# Altium project Motor control board.PrjPcb (part 1 of 2)
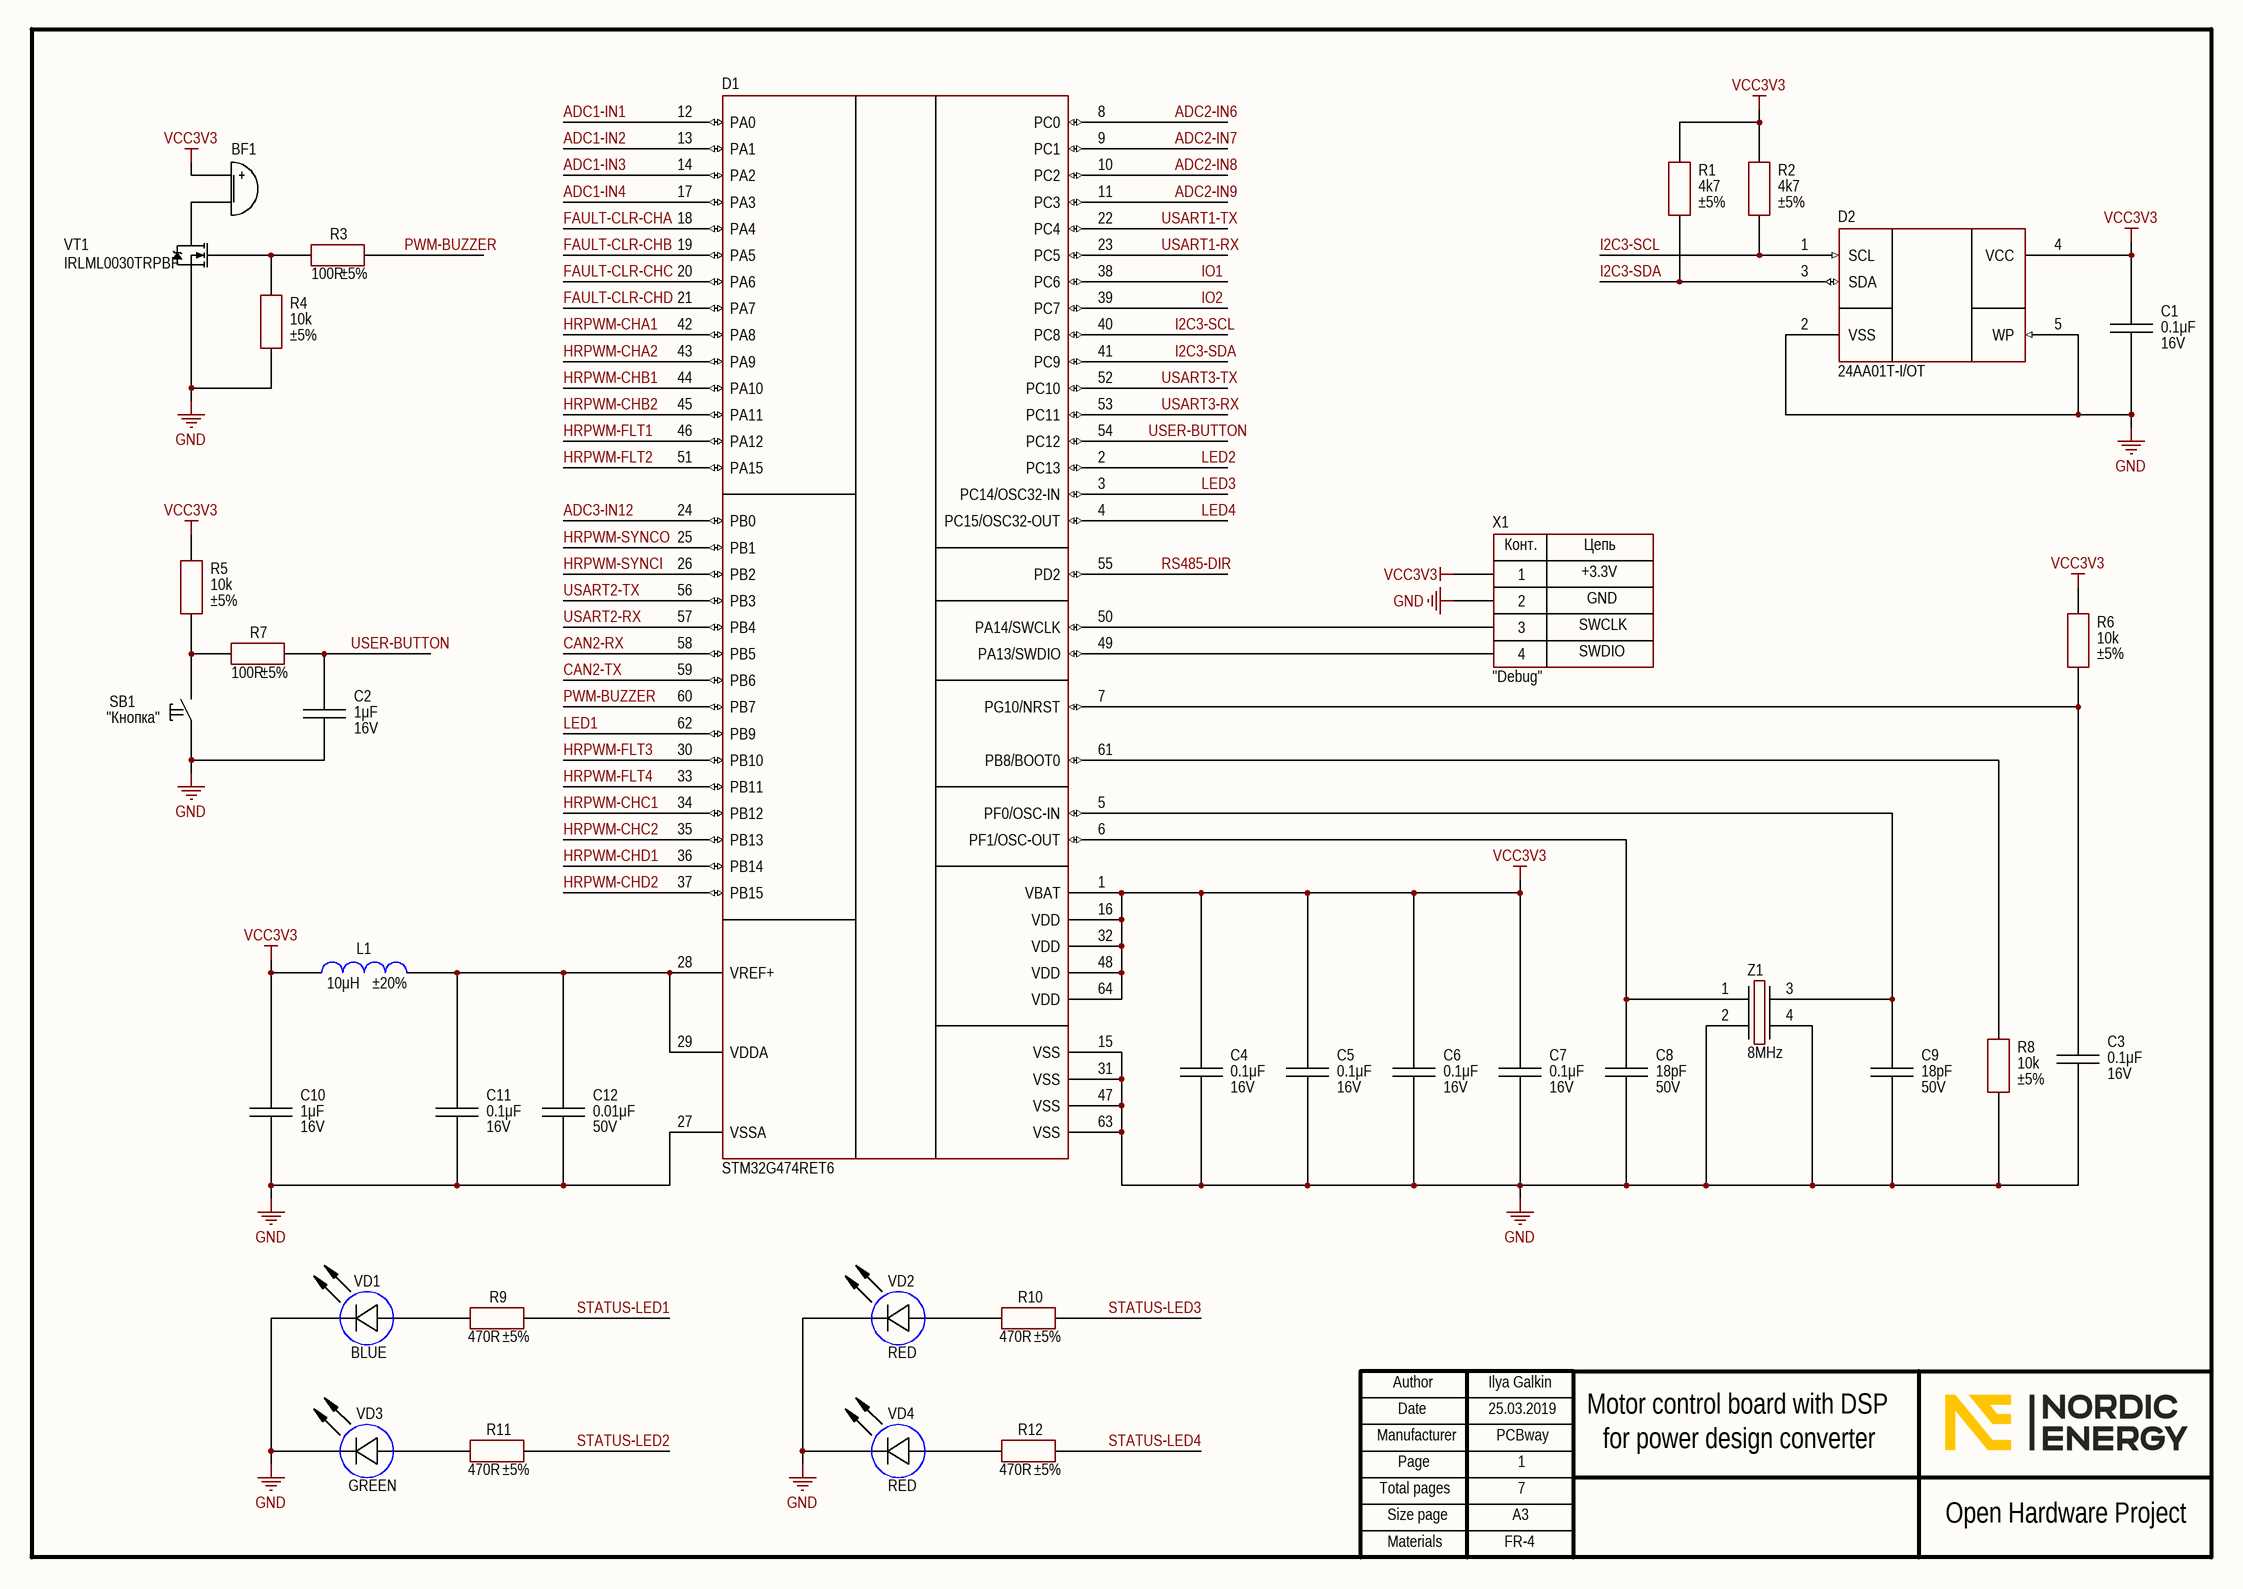
[diagram p0: Main MCU. Page 1.SchDoc]
7 sheets, 169 parts. Net scope: global (net labels, ports and power ports of the same name join across sheets).
Board file: PCB for control board.PcbDoc
Sheets:
  Main MCU. Page 1.SchDoc
  Protection channel A. Page 2.SchDoc
  Protection channel B. Page 3.SchDoc
  Protection channel C. Page 4.SchDoc
  Protection channel D. Page 5.SchDoc
  USB and CAN. Page 6.SchDoc
  Power and system. Page 7.SchDoc

## Sheet Main MCU. Page 1.SchDoc
size 420 x 297 mm; Address1: Address1; Address2: Address2; Address3: Address3; Address4: Address4; DocumentNumber: АБВГ.123456.001 Э3; SheetNumber: 1; SheetTotal: 7; Scale: 1:1; DocumentType: Схема электрическая принципиальная; FirstReferrence: АБВГ.123456.001

### Parts
BF1  (no value)  [BUZ: AT-0927-TT-6-R]
C1  value 0.1μF  Voltage: 16V  [CAP: 0805]
C2  value 1μF  Voltage: 16V  [CAP: 0805]
C3  value 0.1μF  Voltage: 16V  [CAP: 0805]
C4  value 0.1μF  Voltage: 16V  [CAP: 0805]
C5  value 0.1μF  Voltage: 16V  [CAP: 0805]
C6  value 0.1μF  Voltage: 16V  [CAP: 0805]
C7  value 0.1μF  Voltage: 16V  [CAP: 0805]
C8  value 18pF  Voltage: 50V  [CAP: 0805]
C9  value 18pF  Voltage: 50V  [CAP: 0805]
C10  value 1μF  Voltage: 16V  [CAP: 0805]
C11  value 0.1μF  Voltage: 16V  [CAP: 0805]
C12  value 0.01μF  Voltage: 50V  [CAP: 0805]
D1  (no value)  [64-LQFP]
D2  PartNumber: 24AA01T-I/OT  [SOT23-5]
L1  value 10μH  Tolerance: ±20%  [IND: 0805]
R1  value 4k7  Tolerance: ±5%  [RES: 0805]
R2  value 4k7  Tolerance: ±5%  [RES: 0805]
R3  value 100R  Tolerance: ±5%  [RES: 0805]
R4  value 10k  Tolerance: ±5%  [RES: 0805]
R5  value 10k  Tolerance: ±5%  [RES: 0805]
R6  value 10k  Tolerance: ±5%  [RES: 0805]
R7  value 100R  Tolerance: ±5%  [RES: 0805]
R8  value 10k  Tolerance: ±5%  [RES: 0805]
R9  value 470R  Tolerance: ±5%  [RES: 0805]
R10  value 470R  Tolerance: ±5%  [RES: 0805]
R11  value 470R  Tolerance: ±5%  [RES: 0805]
R12  value 470R  Tolerance: ±5%  [RES: 0805]
SB1  CommentText: "Кнопка"  [BUT: 6x6 SMD]
VD1  Color: BLUE  [LED: 0805B]
VD2  Color: RED  [LED: 0805R]
VD3  Color: GREEN  [LED: 0603G]
VD4  Color: RED  [LED: 0805R]
VT1  PartNumber: IRLML0030TRPBF  [SOT23]
X1  CommentText: "Debug"  [CON: SM04B-GHS]
Z1  Frequency: 8MHz  [OSC: 5032]

### Nets
GND: C1.1 C2.1 C3.1 C4.1 C5.1 C6.1 C7.1 C8.1 C9.1 C10.1 C11.1 C12.1 D1.15(VSS) D1.27(VSSA) D1.31(VSS) D1.47(VSS) D1.63(VSS) D2.2(VSS) D2.5(WP) R4.2 R8.2 SB1.1 VD1.2(C) VD2.2(C) VD3.2(C) VD4.2(C) VT1.2(S) X1.2 Z1.2 Z1.4
VCC3V3: BF1.1(+) C1.2 C4.2 C5.2 C6.2 C7.2 C10.2 D1.1(VBAT) D1.16(VDD) D1.32(VDD) D1.48(VDD) D1.64(VDD) D2.4(VCC) L1.2 R1.1 R2.1 R5.1 R6.1 X1.1
ADC1-IN1: D1.12(PA0)
ADC1-IN2: D1.13(PA1)
ADC1-IN3: D1.14(PA2)
ADC1-IN4: D1.17(PA3)
ADC2-IN6: D1.8(PC0)
ADC2-IN7: D1.9(PC1)
ADC2-IN8: D1.10(PC2)
ADC2-IN9: D1.11(PC3)
ADC3-IN12: D1.24(PB0)
CAN2-RX: D1.58(PB5)
CAN2-TX: D1.59(PB6)
FAULT-CLR-CHA: D1.18(PA4)
FAULT-CLR-CHB: D1.19(PA5)
FAULT-CLR-CHC: D1.20(PA6)
FAULT-CLR-CHD: D1.21(PA7)
HRPWM-CHA1: D1.42(PA8)
HRPWM-CHA2: D1.43(PA9)
HRPWM-CHB1: D1.44(PA10)
HRPWM-CHB2: D1.45(PA11)
HRPWM-CHC1: D1.34(PB12)
HRPWM-CHC2: D1.35(PB13)
HRPWM-CHD1: D1.36(PB14)
HRPWM-CHD2: D1.37(PB15)
HRPWM-FLT1: D1.46(PA12)
HRPWM-FLT2: D1.51(PA15)
HRPWM-FLT3: D1.30(PB10)
HRPWM-FLT4: D1.33(PB11)
HRPWM-SYNCI: D1.26(PB2)
HRPWM-SYNCO: D1.25(PB1)
I2C3-SCL: D1.40(PC8) D2.1(SCL) R2.2
I2C3-SDA: D1.41(PC9) D2.3(SDA) R1.2
IO1: D1.38(PC6)
IO2: D1.39(PC7)
LED1: D1.62(PB9)
LED2: D1.2(PC13)
LED3: D1.3(PC14/OSC32-IN)
LED4: D1.4(PC15/OSC32-OUT)
PWM-BUZZER: D1.60(PB7) R3.2
RS485-DIR: D1.55(PD2)
STATUS-LED1: R9.2
STATUS-LED2: R11.2
STATUS-LED3: R10.2
STATUS-LED4: R12.2
USART1-RX: D1.23(PC5)
USART1-TX: D1.22(PC4)
USART2-RX: D1.57(PB4)
USART2-TX: D1.56(PB3)
USART3-RX: D1.53(PC11)
USART3-TX: D1.52(PC10)
USER-BUTTON: C2.2 D1.54(PC12) R7.2
NetBF1_2: BF1.2(-) VT1.3(D)
NetC3_2: C3.2 D1.7(PG10/NRST) R6.2
NetC8_2: C8.2 D1.6(PF1/OSC-OUT) Z1.1
NetC9_2: C9.2 D1.5(PF0/OSC-IN) Z1.3
NetC11_2: C11.2 C12.2 D1.28(VREF+) D1.29(VDDA) L1.1
NetD1_49: D1.49(PA13/SWDIO) X1.4
NetD1_50: D1.50(PA14/SWCLK) X1.3
NetD1_61: D1.61(PB8/BOOT0) R8.1
NetR3_1: R3.1 R4.1 VT1.1(G)
NetR5_2: R5.2 R7.1 SB1.2
NetR9_1: R9.1 VD1.1(A)
NetR10_1: R10.1 VD2.1(A)
NetR11_1: R11.1 VD3.1(A)
NetR12_1: R12.1 VD4.1(A)

### Notes on the sheet
- +3.3V
- SWDIO
- SWCLK
- GND
- Ilya Galkin
- 25.03.2019
- PCBway
- 1
- Motor control board with DSP
- for power design converter
- 7
- FR-4
- Author
- Manufacturer
- Date
- Page
- Total pages
- Size page
- A3
- Open Hardware Project
- Materials
- (in symbol Connector_SM04B) Конт.; Цепь

### Library data of the parts
BF1 = Buzzer: Manufacturer: PUI Audio; ValueManufacturerPartNumber: DIP switch, 2.73 kHz, 3VDC, 80mA, -20...+70°C; PartNumber: AT-0927-TT-6-R; TypeBuzzer: DIP switch; VoltageMax: 3VDC; Frequency: 2.73 kHz; CurrentMax: 80mA; HelpURL: https://www.digikey.com/products/en?keywords=AT-0927-TT-6-R; Temperature: -20...+70°C
C1 C3-C7 C11 = Ceramic_0805: Manufacturer: Yageo; PartNumber: CC0805KRX7R7BB104; ValueManufacturerPartNumber: Ceramic capacitor, 0.1μF, X7R, ±10%, 16V, 0805, -55...+125°C; TypeCapacitor: Ceramic capacitor; Tolerance: ±10%; TypeDielectric: X7R; Package: 0805; HelpURL: https://www.digikey.com/product-detail/en/yageo/CC0805KRX7R7BB104/311-1142-1-ND/303052; Temperature: -55...+125°C
C2 C10 = Ceramic_0805: Manufacturer: Yageo; PartNumber: CC0805KKX7R7BB105; ValueManufacturerPartNumber: Ceramic capacitor, 1μF, X7R, ±10%, 16V, 0805, -55...+125°C; TypeCapacitor: Ceramic capacitor; Tolerance: ±10%; TypeDielectric: X7R; Package: 0805; HelpURL: https://www.digikey.com/product-detail/en/yageo/CC0805KKX7R7BB105/311-1365-1-ND/2103149; Temperature: -55...+125°C
C8 C9 = Ceramic_0805: Manufacturer: Yageo; PartNumber: CC0805JRNPO9BN180; ValueManufacturerPartNumber: Ceramic capacitor, 18pF, NPO, ±10%, 50V, 0805, -55...+125°C; TypeCapacitor: Ceramic capacitor; Tolerance: ±10%; TypeDielectric: NPO; Package: 0805; HelpURL: https://www.digikey.com/product-detail/en/yageo/CC0805JRNPO9BN180/311-1102-1-ND/303012; Temperature: -55...+125°C
C12 = Ceramic_0805: Manufacturer: Yageo; PartNumber: CC0805KRX7R9BB103; ValueManufacturerPartNumber: Ceramic capacitor, 0.01μF, X7R, ±10%, 50V, 0805, -55...+125°C; TypeCapacitor: Ceramic capacitor; Tolerance: ±10%; TypeDielectric: X7R; Package: 0805; HelpURL: https://www.digikey.com/product-detail/en/yageo/CC0805KRX7R9BB103/311-1136-1-ND/303046; Temperature: -55...+125°C
D1 = STM32G474RET6: Cortex-M4; Manufacturer: STMicroelectronics; ValueManufacturerPartNumber: IC microcontroller, 32-Bit, Cortex-M4, 170MHz, 512KB, 128KB, 1.71...3.6V, -40...+85°C, 64-LQFP; Supply: 1.71...3.6V; Speed: 170MHz; CoreSize: 32-Bit; MemoryROM: 512KB; MemoryRAM: 128KB; HelpURL: https://ru.mouser.com/ProductDetail/STMicroelectronics/STM32G474RET6?qs=sGAEpiMZZMuoKKEcg8mMKJ29ob8kKavQ9P%2FqSgFiHIM%252Bu3HfOPgZJg%3D%3D; Package: 64-LQFP; ComponentType: IC microcontroller; Temperature: -40...+85°C; CoreProcessor: Cortex-M4; PartNumber: STM32G474RET6
D2 = 24AA01T: EEPROM; Manufacturer: Microchip Technology; ValueManufacturerPartNumber: IC memory, EEPROM, 1KB (128x8), 400 kHz, I2C, 1.7...5.5V, -40...+85°C, SOT-23-5; Supply: 1.7...5.5V; Speed: 400 kHz; InterfaceData: I2C; MemorySize: 1KB (128x8); HelpURL: https://www.digikey.com/product-detail/en/microchip-technology/24AA01T-I-OT/24AA01T-I-OTCT-ND/857670; Package: SOT-23-5; ComponentType: IC memory; Temperature: -40...+85°C; MemoryType: EEPROM
L1 = Inductor_0805: Manufacturer: Murata Electronics; PartNumber: LQM21FN100M70L; ValueManufacturerPartNumber: Fixed inductor, 10μH, ±20%, 0805, 100mA, -55...+125°C; TypeInductor: Fixed inductor; MaxCurrent: 100mA; Package: 0805; HelpURL: https://www.digikey.com/product-detail/en/murata-electronics-north-america/LQM21FN100M70L/490-4029-1-ND/1016289; Temperature: -55...+125°C
R1 R2 = Resistor_0805: Manufacturer: Yageo; PartNumber: RC0805JR-074K7L; ValueManufacturerPartNumber: Resistor film, 4k7, ±5%, 0805, 0.125W, -55...+125°C; TypeResistor: Resistor film; Power: 0.125W; Package: 0805; HelpURL: https://www.digikey.com/product-detail/en/yageo/RC0805JR-074K7L/311-4.7KARCT-ND/731274; Temperature: -55...+125°C
R3 R7 = Resistor_0805: Manufacturer: Yageo; PartNumber: RC0805JR-07100RL; ValueManufacturerPartNumber: Resistor film, 100R, ±5%, 0805, 0.125W, -55...+125°C; TypeResistor: Resistor film; Power: 0.125W; Package: 0805; HelpURL: https://www.digikey.com/product-detail/en/yageo/RC0805JR-07100RL/311-100ARCT-ND/731185; Temperature: -55...+125°C
R4-R6 R8 = Resistor_0805: Manufacturer: Yageo; PartNumber: RC0805JR-0710KL; ValueManufacturerPartNumber: Resistor film, 10k, ±5%, 0805, 0.125W, -55...+125°C; TypeResistor: Resistor film; Power: 0.125W; Package: 0805; HelpURL: https://www.digikey.com/product-detail/en/yageo/RC0805JR-0710KL/311-10KARCT-ND/731188; Temperature: -55...+125°C
R9-R12 = Resistor_0805: Manufacturer: Yageo; PartNumber: RC0805JR-07470RL; ValueManufacturerPartNumber: Resistor film, 470R, ±5%, 0805, 0.125W, -55...+125°C; TypeResistor: Resistor film; Power: 0.125W; Package: 0805; HelpURL: https://www.digikey.com/product-detail/en/yageo/RC0805JR-07470RL/311-470ARCT-ND/731280; Temperature: -55...+125°C
SB1 = Button_tactile: Manufacturer: TE Connectivity; ValueManufacturerPartNumber: Tactile button, 6x6mm; PartNumber: FSM2JSMAATR; TypeButton: Tactile button; HelpURL: https://www.digikey.com/product-detail/en/te-connectivity-alcoswitch-switches/FSM2JSMAATR/450-1792-1-ND/3503931; Package: 6x6mm
VD1 = LED_single: Manufacturer: Wurth; ValueManufacturerPartNumber: LED, 20mA, 3.2V, 0805, -55...+150°C; PartNumber: 150080BS75000; TypeDiode: LED; Current: 20mA; VoltageDrop: 3.2V; Package: 0805; HelpURL: https://www.digikey.com/product-detail/en/wurth-electronics-inc/150080BS75000/732-4982-1-ND/4489910; Temperature: -55...+150°C
VD2 VD4 = LED_single: Manufacturer: Wurth; ValueManufacturerPartNumber: LED, 20mA, 2V, 0805, -55...+150°C; PartNumber: 150080RS75000; TypeDiode: LED; Current: 20mA; VoltageDrop: 2V; Package: 0805; HelpURL: https://www.digikey.com/product-detail/en/wurth-electronics-inc/150080RS75000/732-4984-1-ND/4489916; Temperature: -55...+150°C
VD3 = LED_single: Manufacturer: Wurth; ValueManufacturerPartNumber: LED, 20mA, 2V, 0805, -55...+150°C; PartNumber: 150080VS75000; TypeDiode: LED; Current: 20mA; VoltageDrop: 2V; Package: 0805; HelpURL: https://www.digikey.com/product-detail/en/wurth-electronics-inc/150080VS75000/732-4986-1-ND/4489922; Temperature: -55...+150°C
VT1 = MOSFET_N_132: Manufacturer: Infineon Technologies; ValueManufacturerPartNumber: MOSFET N-channel transistor, 30V, 5.3A, 2.6nC, 2.5W, 27mOhm, 382pF, SOT-23, -55...+150°C; TypeTransistor: MOSFET N-channel transistor; VoltageDS: 30V; CurrentDS: 5.3A; RDS: 27mOhm; GateCharge: 2.6nC; InputCapacitor: 382pF; MaxPower: 2.5W; Package: SOT-23; HelpURL: https://www.digikey.com/product-detail/en/infineon-technologies/IRLML0030TRPBF/IRLML0030TRPBFCT-ND/2202231; Temperature: -55...+150°C
X1 = Connector_SM04B: Manufacturer: JST; ValueManufacturerPartNumber: Connector, 4pin, 1.25mm, 50VDC, 1A; PartNumber: SM04B-GHS; VoltageMax: 50VDC; Pitch: 1.25mm; CurrentMax: 1A; Multichannel: 4pin; HelpURL: https://www.digikey.com/product-detail/en/jst-sales-america-inc/SM04B-GHS-TB-LF-SN/455-1566-1-ND/807834; TypeConnector: Connector
Z1 = Crystal_5032: Manufacturer: Diodes Incorporated; PartNumber: ABM3B-8.000MHZ-B2-T; ValueManufacturerPartNumber: Crystal, 8MHz, 18pF, ±30ppm, case 5032, -20...+70°C; LoadCapacitance: 18pF; Tolerance: ±30ppm; Package: case 5032; HelpURL: https://www.digikey.com/product-detail/en/abracon-llc/ABM3B-8.000MHZ-B2-T/535-9720-1-ND/1873254; Temperature: -20...+70°C; TypeOscilator: Crystal

## Sheet Protection channel A. Page 2.SchDoc
size 420 x 297 mm; Address1: Address1; Address2: Address2; Address3: Address3; Address4: Address4; DocumentNumber: АБВГ.123456.001 Э3; SheetNumber: 2; SheetTotal: 7; Scale: 1:1; DocumentType: Схема электрическая принципиальная; FirstReferrence: АБВГ.123456.001
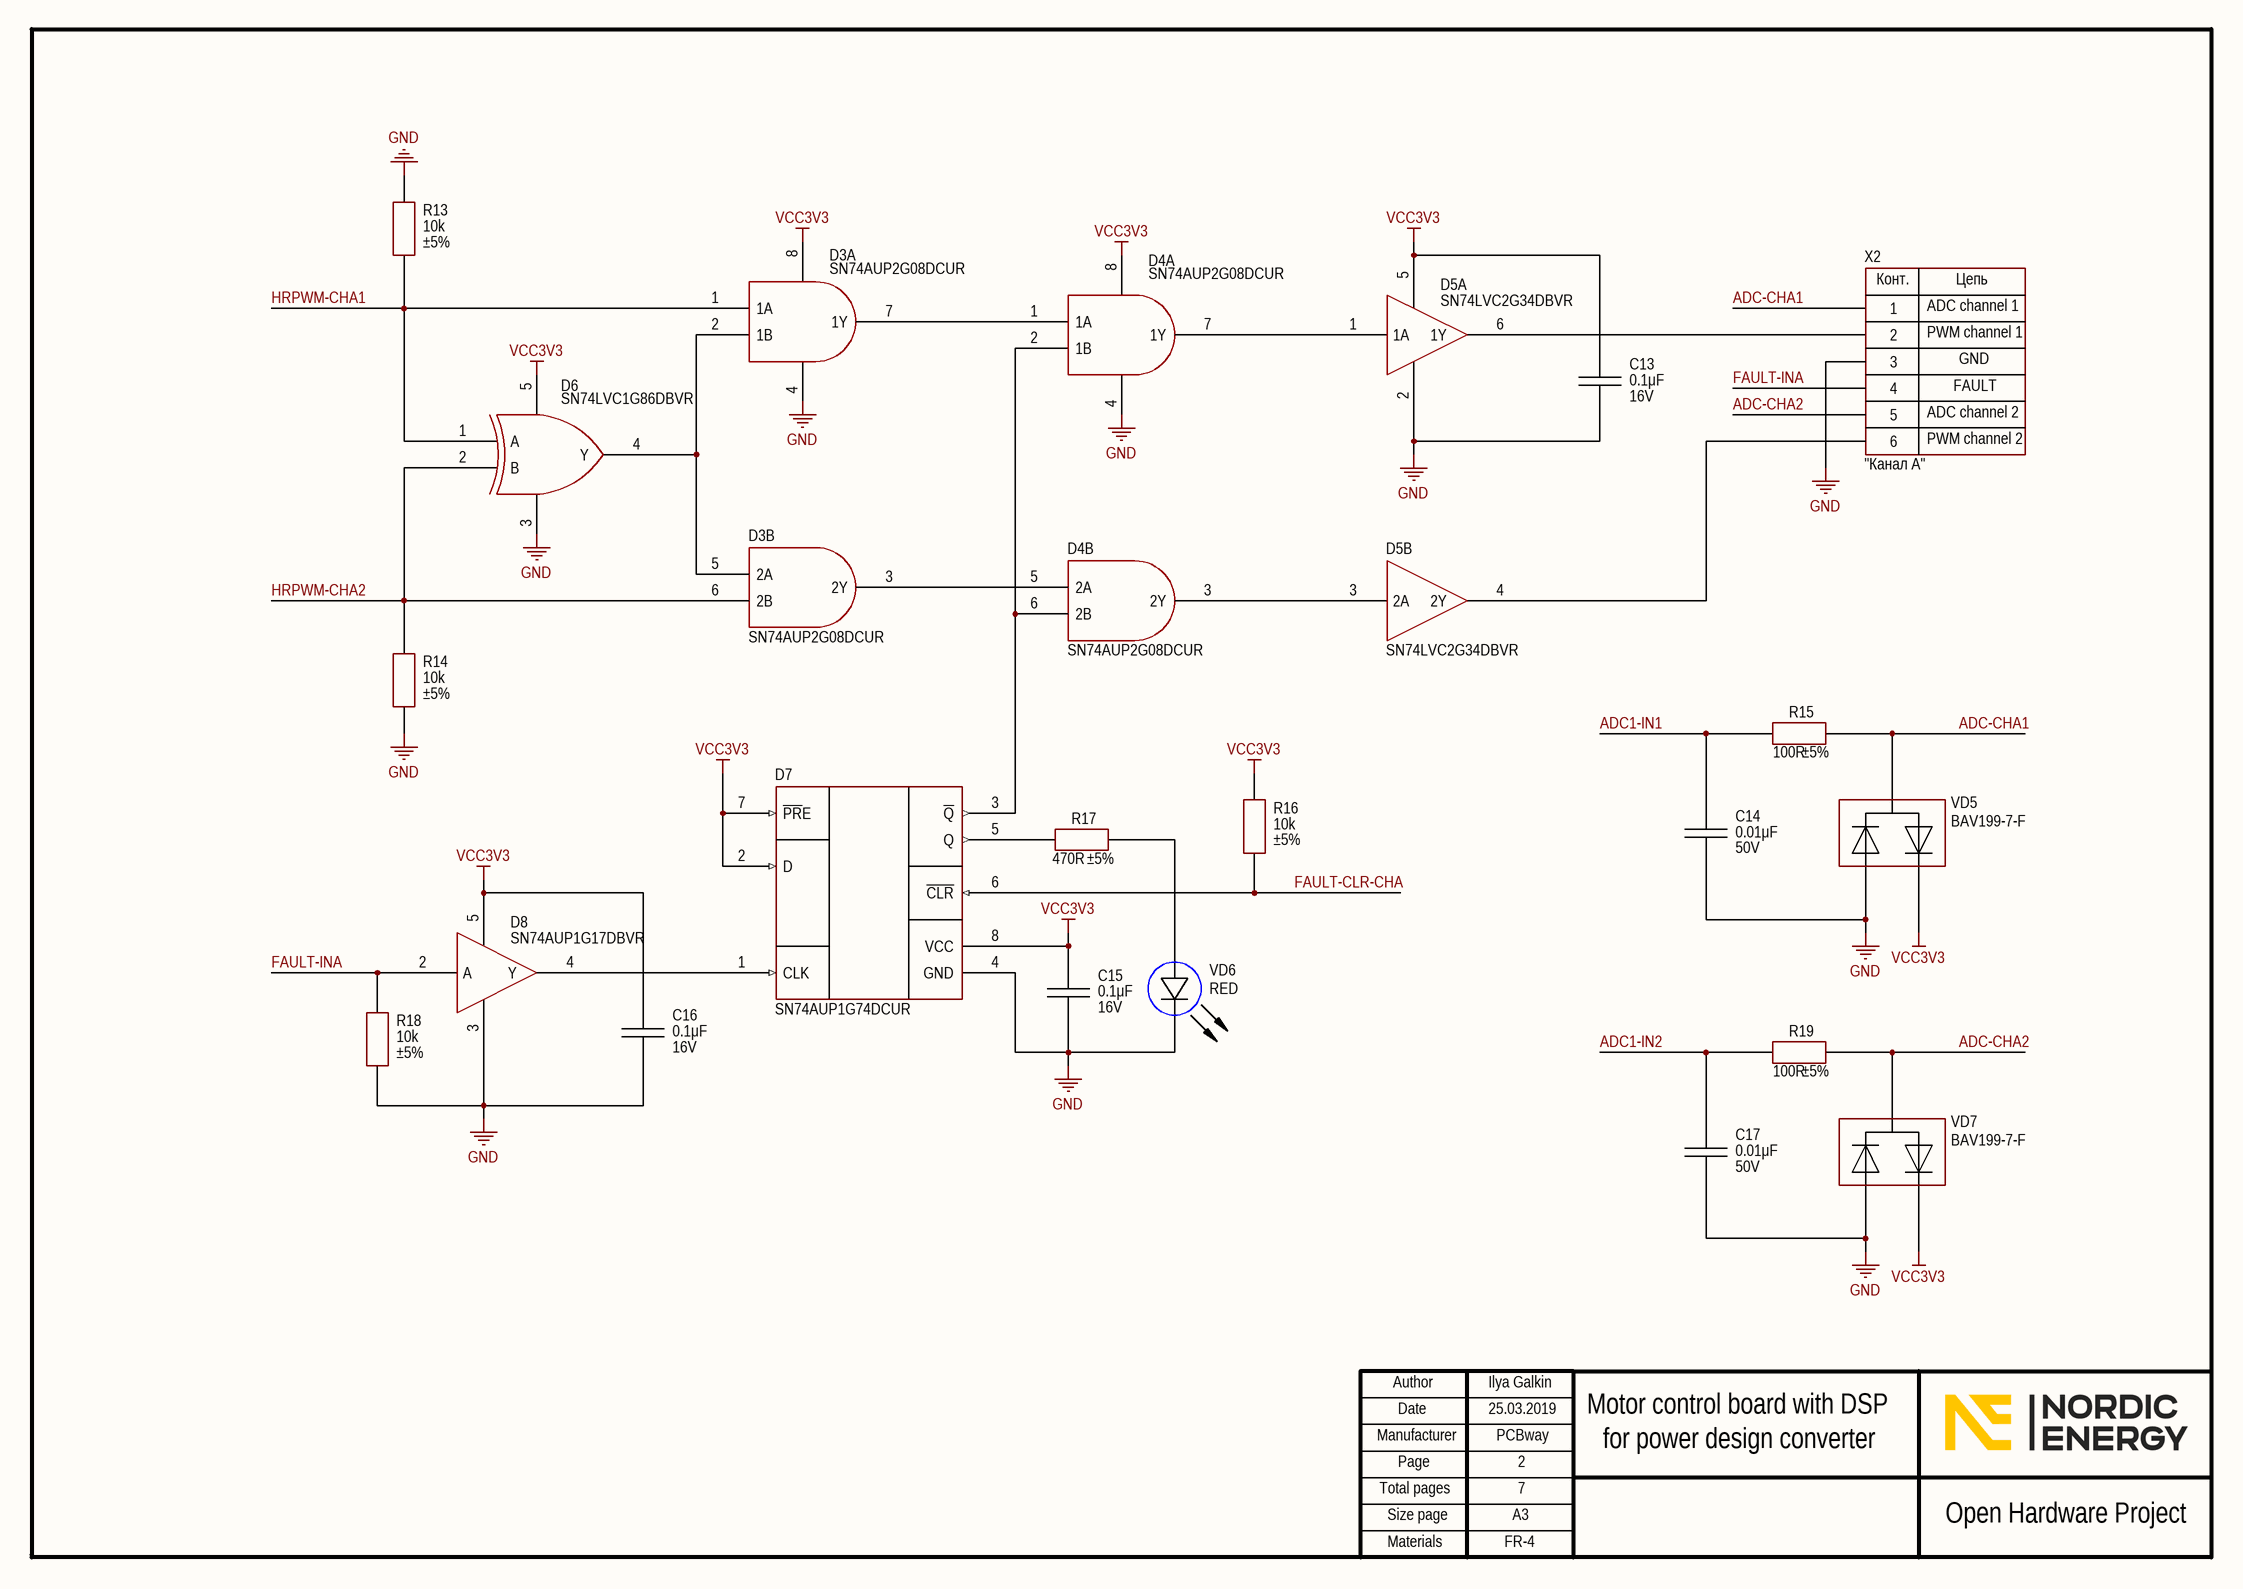
[diagram p1: Protection channel A. Page 2.SchDoc]

### Parts
C13  value 0.1μF  Voltage: 16V  [CAP: 0805]
C14  value 0.01μF  Voltage: 50V  [CAP: 0805]
C15  value 0.1μF  Voltage: 16V  [CAP: 0805]
C16  value 0.1μF  Voltage: 16V  [CAP: 0805]
C17  value 0.01μF  Voltage: 50V  [CAP: 0805]
D3  (no value)  [8-VSSOP]  (parts A,B of 2)
D4  (no value)  [8-VSSOP]  (parts A,B of 2)
D5  (no value)  [SOT23-6]  (parts A,B of 2)
D6  (no value)  [SOT23-5]
D7  (no value)  [8-VSSOP]
D8  (no value)  [SOT23-5]
R13  value 10k  Tolerance: ±5%  [RES: 0805]
R14  value 10k  Tolerance: ±5%  [RES: 0805]
R15  value 100R  Tolerance: ±5%  [RES: 0805]
R16  value 10k  Tolerance: ±5%  [RES: 0805]
R17  value 470R  Tolerance: ±5%  [RES: 0805]
R18  value 10k  Tolerance: ±5%  [RES: 0805]
R19  value 100R  Tolerance: ±5%  [RES: 0805]
VD5  PartNumber: BAV199-7-F  [SOT23]
VD6  Color: RED  [LED: 0805R]
VD7  PartNumber: BAV199-7-F  [SOT23]
X2  CommentText: "Канал А"  [CON: PLD-6]

### Nets
GND: C13.1 C14.1 C15.1 C16.1 C17.1 D3.4 D4.4 D5.2 D6.3 D7.4(GND) D8.3 R13.1 R14.2 R18.2 VD5.1 VD6.2(C) VD7.1 X2.3
VCC3V3: C13.2 C15.2 C16.2 D3.8 D4.8 D5.5 D6.5 D7.2(D) D7.7(~{PR}E) D7.8(VCC) D8.5 R16.1 VD5.2 VD7.2
ADC1-IN1: C14.2 R15.1
ADC1-IN2: C17.2 R19.1
ADC-CHA1: R15.2 VD5.3 X2.1
ADC-CHA2: R19.2 VD7.3 X2.5
FAULT-CLR-CHA: D7.6(~{CLR}) R16.2
FAULT-INA: D8.2(A) R18.1 X2.4
HRPWM-CHA1: D3.1(1A) D6.1(A) R13.2
HRPWM-CHA2: D3.6(2B) D6.2(B) R14.1
NetD3_2: D3.2(1B) D3.5(2A) D6.4(Y)
NetD3_3: D3.3(2Y) D4.5(2A)
NetD3_7: D3.7(1Y) D4.1(1A)
NetD4_2: D4.2(1B) D4.6(2B) D7.3(~{Q})
NetD4_3: D4.3(2Y) D5.3(2A)
NetD4_7: D4.7(1Y) D5.1(1A)
NetD5_4: D5.4(2Y) X2.6
NetD5_6: D5.6(1Y) X2.2
NetD7_1: D7.1(CLK) D8.4(Y)
NetD7_5: D7.5(Q) R17.2
NetR17_1: R17.1 VD6.1(A)

### Notes on the sheet
- ADC channel 1
- PWM channel 1
- FAULT
- GND
- ADC channel 2
- PWM channel 2
- Ilya Galkin
- 25.03.2019
- PCBway
- 2
- Motor control board with DSP
- for power design converter
- 7
- FR-4
- Author
- Manufacturer
- Date
- Page
- Total pages
- Size page
- A3
- Open Hardware Project
- Materials
- (in symbol PLD-6) Конт.; Цепь

### Library data of the parts
C13 C15 C16 = Ceramic_0805: as C1 on sheet Main MCU. Page 1; Package: 0805; HelpURL: https://www.digikey.com/product-detail/en/yageo/CC0805KRX7R7BB104/311-1142-1-ND/303052; Temperature: -55...+125°C
C14 C17 = Ceramic_0805: as C12 on sheet Main MCU. Page 1; Package: 0805; HelpURL: https://www.digikey.com/product-detail/en/yageo/CC0805KRX7R9BB103/311-1136-1-ND/303046; Temperature: -55...+125°C
D3 D4 = SN74AUP2G08DCUR: AND; Manufacturer: Texas Instruments; ValueManufacturerPartNumber: IC logic AND, 0.8...3.6V, -40...+855°C, 8-VSSOP; Supply: 0.8...3.6V; HelpURL: https://www.digikey.com/product-detail/en/texas-instruments/SN74AUP2G08DCUR/296-32271-1-ND/3505517; Package: 8-VSSOP; ComponentType: IC logic AND; Temperature: -40...+855°C; PartNumber: SN74AUP2G08DCUR
D5 = SN74LVC2G34DBVR: Buffer; Manufacturer: Texas Instruments; ValueManufacturerPartNumber: IC logic buffer, 1.65...5.5V, -40...+125°C, SOT23-6; Supply: 1.65...5.5V; HelpURL: https://www.digikey.com/product-detail/en/texas-instruments/SN74LVC2G34DBVR/296-13496-1-ND/486431; Package: SOT23-6; ComponentType: IC logic buffer; Temperature: -40...+125°C; PartNumber: SN74LVC2G34DBVR
D6 = SN74LVC1G86DBVR: XOR; Manufacturer: Texas Instruments; ValueManufacturerPartNumber: IC logic XOR, 1.65...5.5V, -40...+125°C, SOT23-5; Supply: 1.65...5.5V; HelpURL: https://www.digikey.com/product-detail/en/texas-instruments/SN74LVC1G86DBVR/296-9853-1-ND/380077; Package: SOT23-5; ComponentType: IC logic XOR; Temperature: -40...+125°C; PartNumber: SN74LVC1G86DBVR
D7 = SN74AUP1G74DCUR: D-trigger; Manufacturer: Texas Instruments; ValueManufacturerPartNumber: ICtrigger D-type, 0.8...3.6V, -40...+85°C, 8-VSSOP; Supply: 0.8...3.6V; HelpURL: https://www.digikey.com/product-detail/en/texas-instruments/SN74AUP1G74DCUR/296-19761-1-ND/1091423; Package: 8-VSSOP; ComponentType: ICtrigger D-type; Temperature: -40...+85°C; PartNumber: SN74AUP1G74DCUR
D8 = SN74AUP1G17DBVR: Schmitt trigger; Manufacturer: Texas Instruments; ValueManufacturerPartNumber: IC Schmitt trigger, 0.8...3.6V, -40...+85°C, SOT23-6; Supply: 0.8...3.6V; HelpURL: https://www.digikey.com/product-detail/en/texas-instruments/SN74AUP1G17DBVR/296-19077-1-ND/864308; Package: SOT23-6; ComponentType: IC Schmitt trigger; Temperature: -40...+85°C; PartNumber: SN74AUP1G17DBVR
R13 R14 R16 R18 = Resistor_0805: as R4 on sheet Main MCU. Page 1; Package: 0805; HelpURL: https://www.digikey.com/product-detail/en/yageo/RC0805JR-0710KL/311-10KARCT-ND/731188; Temperature: -55...+125°C
R15 R19 = Resistor_0805: as R3 on sheet Main MCU. Page 1; Package: 0805; HelpURL: https://www.digikey.com/product-detail/en/yageo/RC0805JR-07100RL/311-100ARCT-ND/731185; Temperature: -55...+125°C
R17 = Resistor_0805: as R9 on sheet Main MCU. Page 1; Package: 0805; HelpURL: https://www.digikey.com/product-detail/en/yageo/RC0805JR-07470RL/311-470ARCT-ND/731280; Temperature: -55...+125°C
VD5 VD7 = Diode_array: Manufacturer: Diodes Incorporated; ValueManufacturerPartNumber: Diode array, 85V, 140mA, 1.1V, 3us, SOT-23, -65...+150°C; TypeDiode: Diode array; Voltage: 85V; Current: 140mA; VoltageDrop: 1.1V; RecoveryTime: 3us; Package: SOT-23; HelpURL: https://www.digikey.com/product-detail/en/diodes-incorporated/BAV199-7-F/BAV199-FDICT-ND/1033647; Temperature: -65...+150°C
VD6 = LED_single: as VD2 on sheet Main MCU. Page 1; Package: 0805; HelpURL: https://www.digikey.com/product-detail/en/wurth-electronics-inc/150080RS75000/732-4984-1-ND/4489916; Temperature: -55...+150°C
X2 = PLD-6: Manufacturer: Connfly; ValueManufacturerPartNumber: Connector, 6pin, 2.54mm, 500VAC, 3A; TypeConnector: Connector; VoltageMax: 500VAC; Pitch: 2.54mm; CurrentMax: 3A; Multichannel: 6pin; HelpURL: https://www.chipdip.ru/product/pld-6; PartNumber: PLD-6

## Sheet Protection channel B. Page 3.SchDoc
size 420 x 297 mm; Address1: Address1; Address2: Address2; Address3: Address3; Address4: Address4; DocumentNumber: АБВГ.123456.001 Э3; SheetNumber: 3; SheetTotal: 7; Scale: 1:1; DocumentType: Схема электрическая принципиальная; FirstReferrence: АБВГ.123456.001
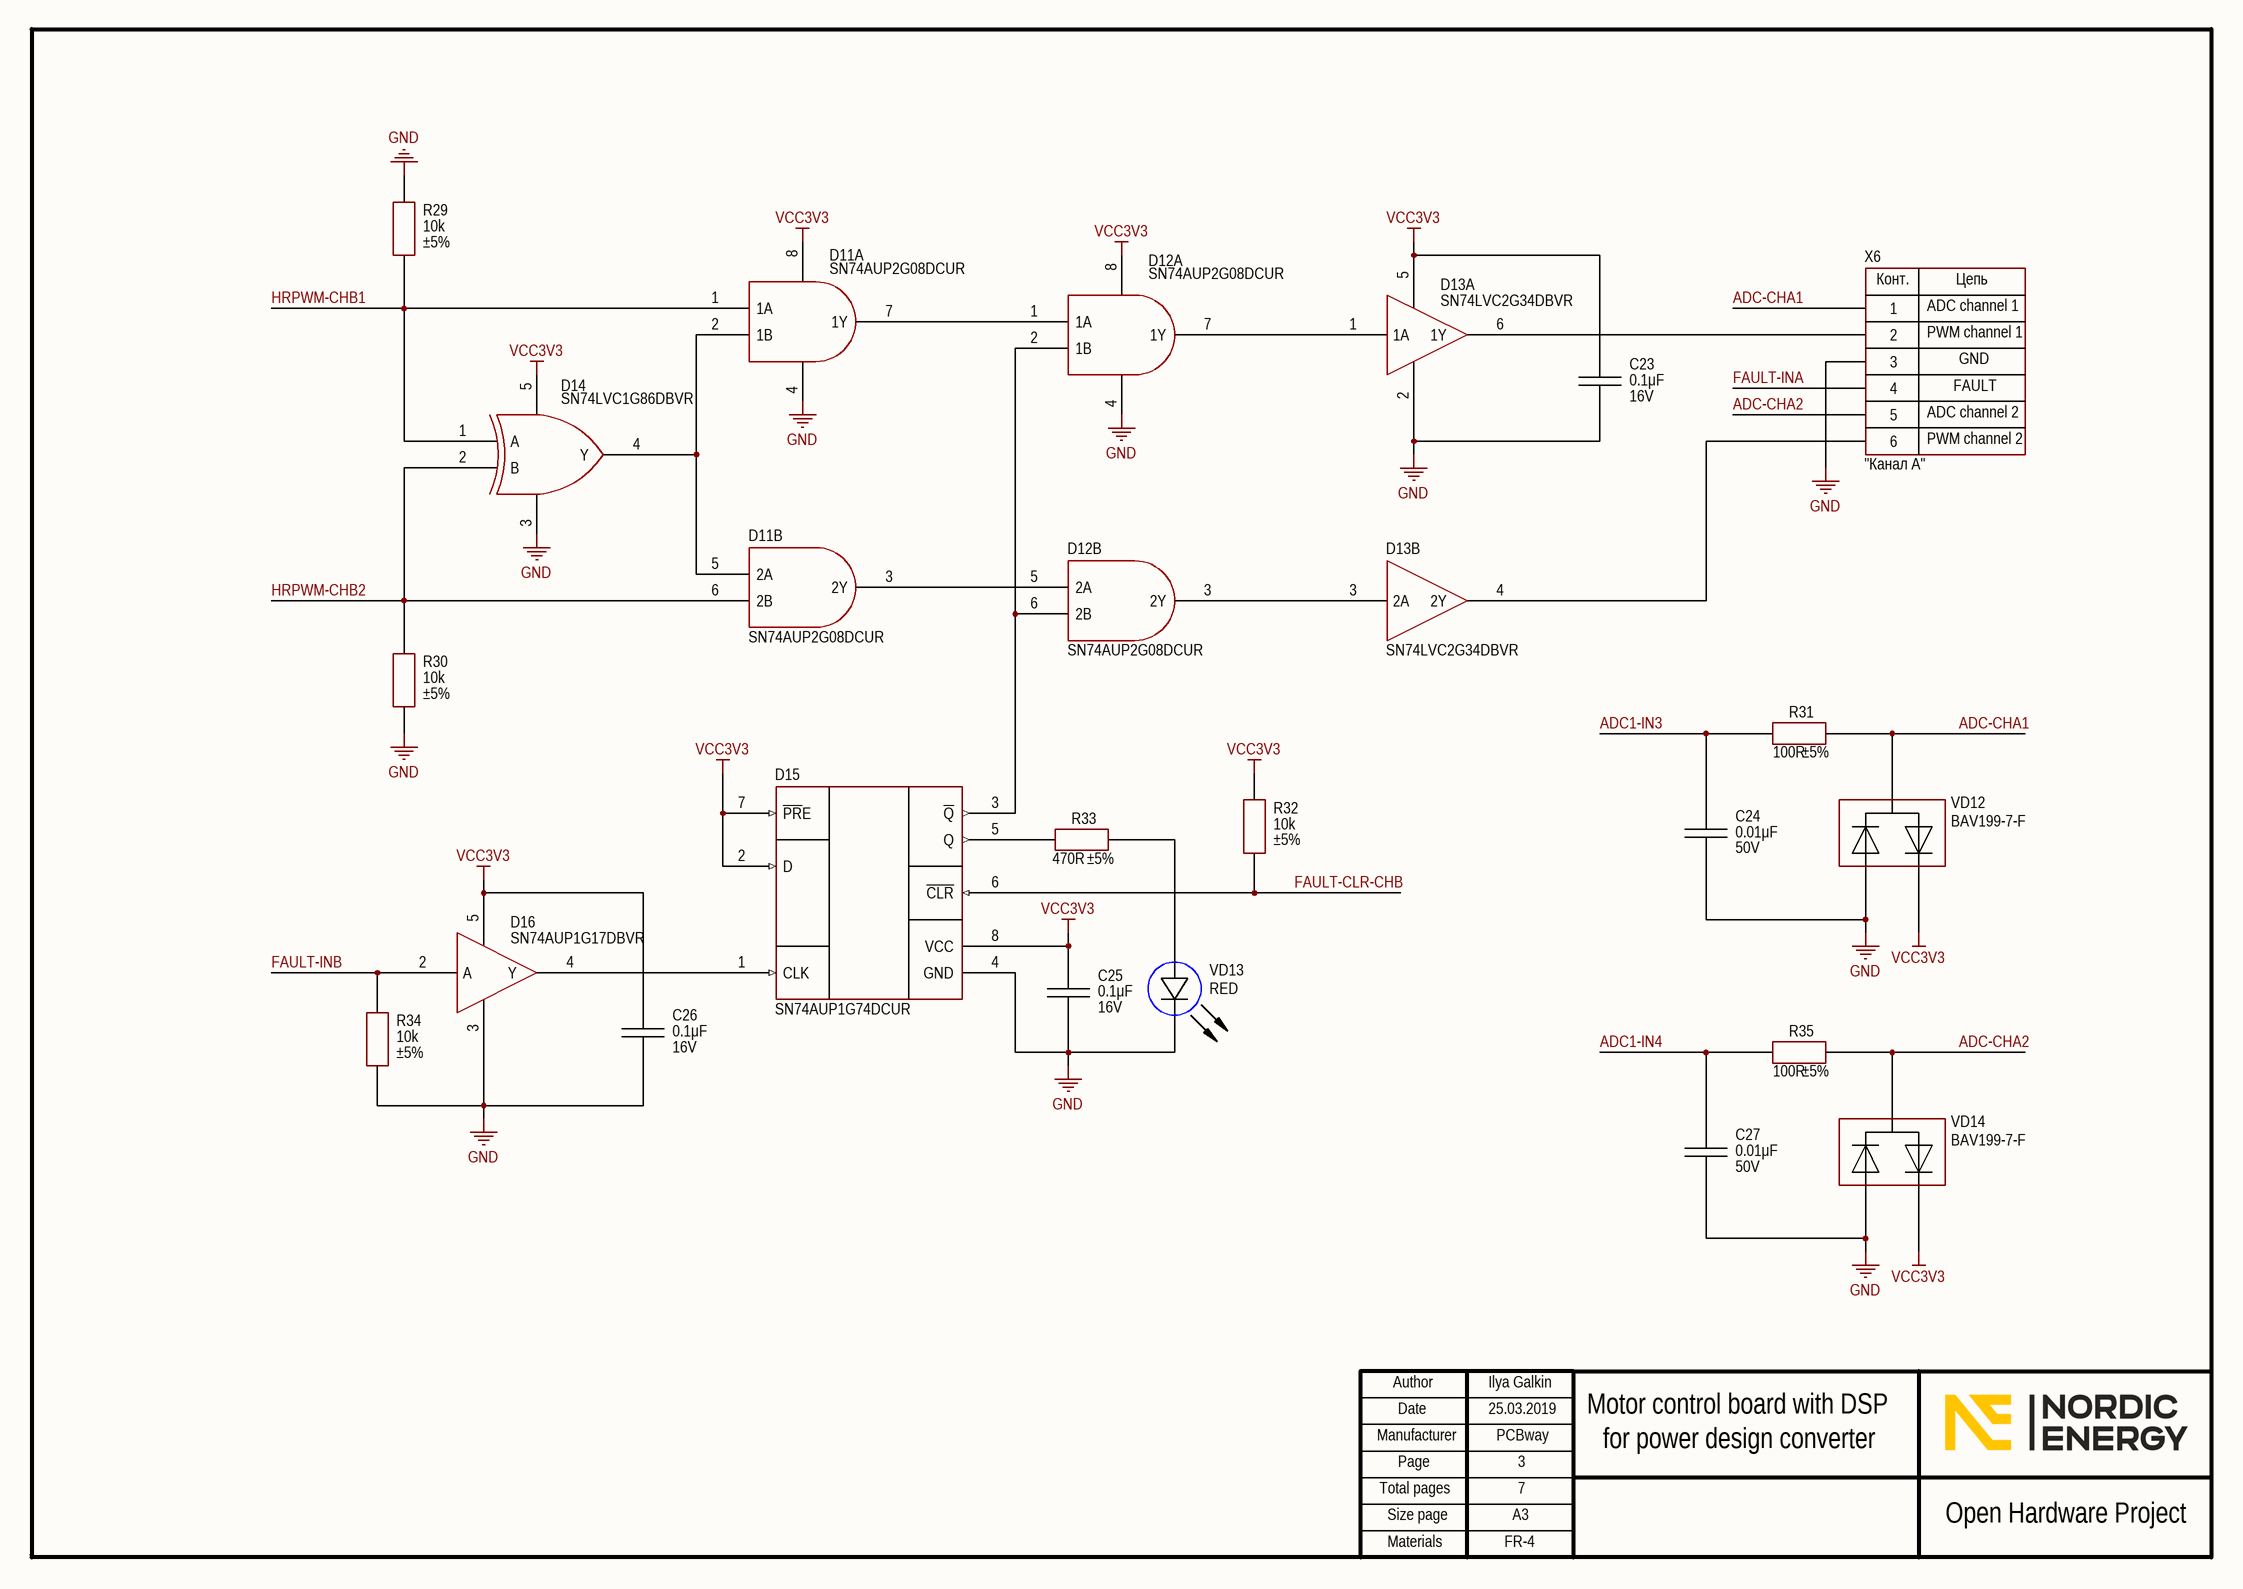
[diagram p2: Protection channel B. Page 3.SchDoc]

### Parts
C23  value 0.1μF  Voltage: 16V  [CAP: 0805]
C24  value 0.01μF  Voltage: 50V  [CAP: 0805]
C25  value 0.1μF  Voltage: 16V  [CAP: 0805]
C26  value 0.1μF  Voltage: 16V  [CAP: 0805]
C27  value 0.01μF  Voltage: 50V  [CAP: 0805]
D11  (no value)  [8-VSSOP]  (parts A,B of 2)
D12  (no value)  [8-VSSOP]  (parts A,B of 2)
D13  (no value)  [SOT23-6]  (parts A,B of 2)
D14  (no value)  [SOT23-5]
D15  (no value)  [8-VSSOP]
D16  (no value)  [SOT23-5]
R29  value 10k  Tolerance: ±5%  [RES: 0805]
R30  value 10k  Tolerance: ±5%  [RES: 0805]
R31  value 100R  Tolerance: ±5%  [RES: 0805]
R32  value 10k  Tolerance: ±5%  [RES: 0805]
R33  value 470R  Tolerance: ±5%  [RES: 0805]
R34  value 10k  Tolerance: ±5%  [RES: 0805]
R35  value 100R  Tolerance: ±5%  [RES: 0805]
VD12  PartNumber: BAV199-7-F  [SOT23]
VD13  Color: RED  [LED: 0805R]
VD14  PartNumber: BAV199-7-F  [SOT23]
X6  CommentText: "Канал А"  [CON: PLD-6]

### Nets
GND: C23.1 C24.1 C25.1 C26.1 C27.1 D11.4 D12.4 D13.2 D14.3 D15.4(GND) D16.3 R29.1 R30.2 R34.2 VD12.1 VD13.2(C) VD14.1 X6.3
VCC3V3: C23.2 C25.2 C26.2 D11.8 D12.8 D13.5 D14.5 D15.2(D) D15.7(~{PR}E) D15.8(VCC) D16.5 R32.1 VD12.2 VD14.2
ADC1-IN3: C24.2 R31.1
ADC1-IN4: C27.2 R35.1
ADC-CHA1: R31.2 VD12.3 X6.1
ADC-CHA2: R35.2 VD14.3 X6.5
FAULT-CLR-CHB: D15.6(~{CLR}) R32.2
FAULT-INA: X6.4
FAULT-INB: D16.2(A) R34.1
HRPWM-CHB1: D11.1(1A) D14.1(A) R29.2
HRPWM-CHB2: D11.6(2B) D14.2(B) R30.1
NetD11_2: D11.2(1B) D11.5(2A) D14.4(Y)
NetD11_3: D11.3(2Y) D12.5(2A)
NetD11_7: D11.7(1Y) D12.1(1A)
NetD12_2: D12.2(1B) D12.6(2B) D15.3(~{Q})
NetD12_3: D12.3(2Y) D13.3(2A)
NetD12_7: D12.7(1Y) D13.1(1A)
NetD13_4: D13.4(2Y) X6.6
NetD13_6: D13.6(1Y) X6.2
NetD15_1: D15.1(CLK) D16.4(Y)
NetD15_5: D15.5(Q) R33.2
NetR33_1: R33.1 VD13.1(A)

### Notes on the sheet
- ADC channel 1
- PWM channel 1
- FAULT
- GND
- ADC channel 2
- PWM channel 2
- Ilya Galkin
- 25.03.2019
- PCBway
- 3
- Motor control board with DSP
- for power design converter
- 7
- FR-4
- Author
- Manufacturer
- Date
- Page
- Total pages
- Size page
- A3
- Open Hardware Project
- Materials
- (in symbol PLD-6) Конт.; Цепь

### Library data of the parts
C23 C25 C26 = Ceramic_0805: as C1 on sheet Main MCU. Page 1; Package: 0805; HelpURL: https://www.digikey.com/product-detail/en/yageo/CC0805KRX7R7BB104/311-1142-1-ND/303052; Temperature: -55...+125°C
C24 C27 = Ceramic_0805: as C12 on sheet Main MCU. Page 1; Package: 0805; HelpURL: https://www.digikey.com/product-detail/en/yageo/CC0805KRX7R9BB103/311-1136-1-ND/303046; Temperature: -55...+125°C
D11 D12 = SN74AUP2G08DCUR: as D3 on sheet Protection channel A. Page 2; HelpURL: https://www.digikey.com/product-detail/en/texas-instruments/SN74AUP2G08DCUR/296-32271-1-ND/3505517; Package: 8-VSSOP; ComponentType: IC logic AND; Temperature: -40...+855°C; PartNumber: SN74AUP2G08DCUR
D13 = SN74LVC2G34DBVR: as D5 on sheet Protection channel A. Page 2; HelpURL: https://www.digikey.com/product-detail/en/texas-instruments/SN74LVC2G34DBVR/296-13496-1-ND/486431; Package: SOT23-6; ComponentType: IC logic buffer; Temperature: -40...+125°C; PartNumber: SN74LVC2G34DBVR
D14 = SN74LVC1G86DBVR: as D6 on sheet Protection channel A. Page 2; HelpURL: https://www.digikey.com/product-detail/en/texas-instruments/SN74LVC1G86DBVR/296-9853-1-ND/380077; Package: SOT23-5; ComponentType: IC logic XOR; Temperature: -40...+125°C; PartNumber: SN74LVC1G86DBVR
D15 = SN74AUP1G74DCUR: as D7 on sheet Protection channel A. Page 2; HelpURL: https://www.digikey.com/product-detail/en/texas-instruments/SN74AUP1G74DCUR/296-19761-1-ND/1091423; Package: 8-VSSOP; ComponentType: ICtrigger D-type; Temperature: -40...+85°C; PartNumber: SN74AUP1G74DCUR
D16 = SN74AUP1G17DBVR: as D8 on sheet Protection channel A. Page 2; HelpURL: https://www.digikey.com/product-detail/en/texas-instruments/SN74AUP1G17DBVR/296-19077-1-ND/864308; Package: SOT23-6; ComponentType: IC Schmitt trigger; Temperature: -40...+85°C; PartNumber: SN74AUP1G17DBVR
R29 R30 R32 R34 = Resistor_0805: as R4 on sheet Main MCU. Page 1; Package: 0805; HelpURL: https://www.digikey.com/product-detail/en/yageo/RC0805JR-0710KL/311-10KARCT-ND/731188; Temperature: -55...+125°C
R31 R35 = Resistor_0805: as R3 on sheet Main MCU. Page 1; Package: 0805; HelpURL: https://www.digikey.com/product-detail/en/yageo/RC0805JR-07100RL/311-100ARCT-ND/731185; Temperature: -55...+125°C
R33 = Resistor_0805: as R9 on sheet Main MCU. Page 1; Package: 0805; HelpURL: https://www.digikey.com/product-detail/en/yageo/RC0805JR-07470RL/311-470ARCT-ND/731280; Temperature: -55...+125°C
VD12 VD14 = Diode_array: as VD5 on sheet Protection channel A. Page 2; Package: SOT-23; HelpURL: https://www.digikey.com/product-detail/en/diodes-incorporated/BAV199-7-F/BAV199-FDICT-ND/1033647; Temperature: -65...+150°C
VD13 = LED_single: as VD2 on sheet Main MCU. Page 1; Package: 0805; HelpURL: https://www.digikey.com/product-detail/en/wurth-electronics-inc/150080RS75000/732-4984-1-ND/4489916; Temperature: -55...+150°C
X6 = PLD-6: as X2 on sheet Protection channel A. Page 2; HelpURL: https://www.chipdip.ru/product/pld-6; PartNumber: PLD-6

## Sheet Protection channel C. Page 4.SchDoc
size 420 x 297 mm; Address1: Address1; Address2: Address2; Address3: Address3; Address4: Address4; DocumentNumber: АБВГ.123456.001 Э3; SheetNumber: 4; SheetTotal: 7; Scale: 1:1; DocumentType: Схема электрическая принципиальная; FirstReferrence: АБВГ.123456.001
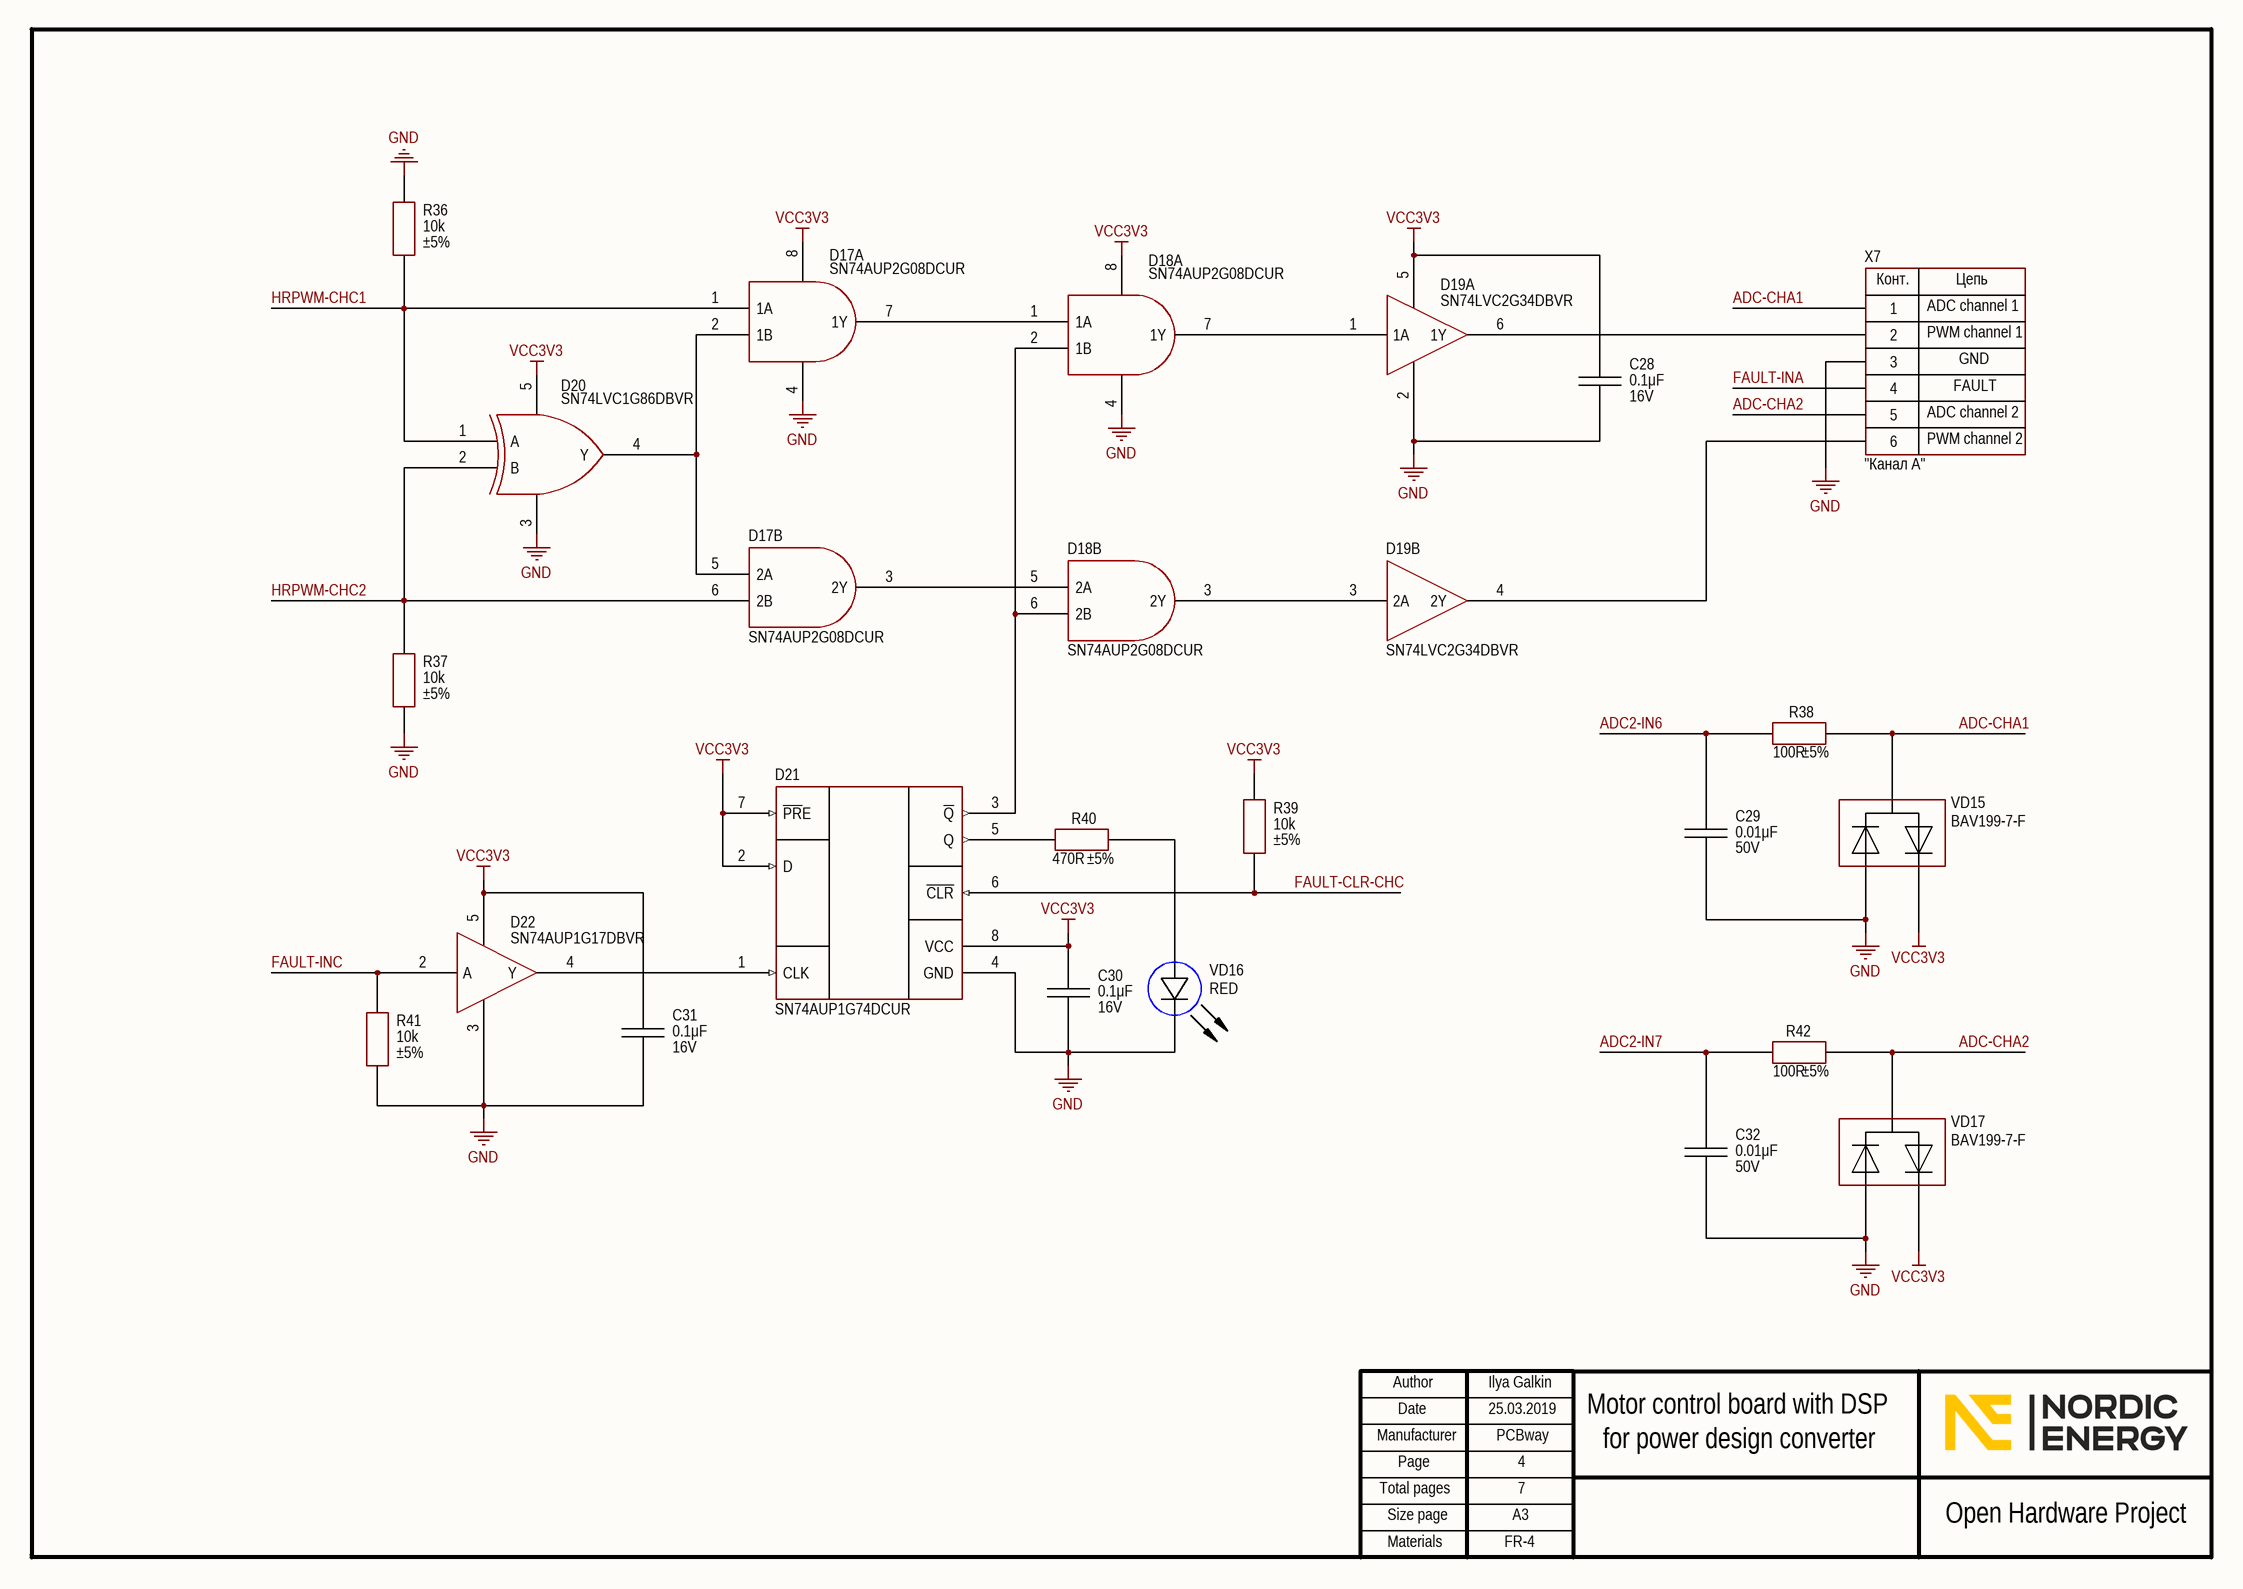
[diagram p3: Protection channel C. Page 4.SchDoc]

### Parts
C28  value 0.1μF  Voltage: 16V  [CAP: 0805]
C29  value 0.01μF  Voltage: 50V  [CAP: 0805]
C30  value 0.1μF  Voltage: 16V  [CAP: 0805]
C31  value 0.1μF  Voltage: 16V  [CAP: 0805]
C32  value 0.01μF  Voltage: 50V  [CAP: 0805]
D17  (no value)  [8-VSSOP]  (parts A,B of 2)
D18  (no value)  [8-VSSOP]  (parts A,B of 2)
D19  (no value)  [SOT23-6]  (parts A,B of 2)
D20  (no value)  [SOT23-5]
D21  (no value)  [8-VSSOP]
D22  (no value)  [SOT23-5]
R36  value 10k  Tolerance: ±5%  [RES: 0805]
R37  value 10k  Tolerance: ±5%  [RES: 0805]
R38  value 100R  Tolerance: ±5%  [RES: 0805]
R39  value 10k  Tolerance: ±5%  [RES: 0805]
R40  value 470R  Tolerance: ±5%  [RES: 0805]
R41  value 10k  Tolerance: ±5%  [RES: 0805]
R42  value 100R  Tolerance: ±5%  [RES: 0805]
VD15  PartNumber: BAV199-7-F  [SOT23]
VD16  Color: RED  [LED: 0805R]
VD17  PartNumber: BAV199-7-F  [SOT23]
X7  CommentText: "Канал А"  [CON: PLD-6]

### Nets
GND: C28.1 C29.1 C30.1 C31.1 C32.1 D17.4 D18.4 D19.2 D20.3 D21.4(GND) D22.3 R36.1 R37.2 R41.2 VD15.1 VD16.2(C) VD17.1 X7.3
VCC3V3: C28.2 C30.2 C31.2 D17.8 D18.8 D19.5 D20.5 D21.2(D) D21.7(~{PR}E) D21.8(VCC) D22.5 R39.1 VD15.2 VD17.2
ADC2-IN6: C29.2 R38.1
ADC2-IN7: C32.2 R42.1
ADC-CHA1: R38.2 VD15.3 X7.1
ADC-CHA2: R42.2 VD17.3 X7.5
FAULT-CLR-CHC: D21.6(~{CLR}) R39.2
FAULT-INA: X7.4
FAULT-INC: D22.2(A) R41.1
HRPWM-CHC1: D17.1(1A) D20.1(A) R36.2
HRPWM-CHC2: D17.6(2B) D20.2(B) R37.1
NetD17_2: D17.2(1B) D17.5(2A) D20.4(Y)
NetD17_3: D17.3(2Y) D18.5(2A)
NetD17_7: D17.7(1Y) D18.1(1A)
NetD18_2: D18.2(1B) D18.6(2B) D21.3(~{Q})
NetD18_3: D18.3(2Y) D19.3(2A)
NetD18_7: D18.7(1Y) D19.1(1A)
NetD19_4: D19.4(2Y) X7.6
NetD19_6: D19.6(1Y) X7.2
NetD21_1: D21.1(CLK) D22.4(Y)
NetD21_5: D21.5(Q) R40.2
NetR40_1: R40.1 VD16.1(A)

### Notes on the sheet
- ADC channel 1
- PWM channel 1
- FAULT
- GND
- ADC channel 2
- PWM channel 2
- Ilya Galkin
- 25.03.2019
- PCBway
- 4
- Motor control board with DSP
- for power design converter
- 7
- FR-4
- Author
- Manufacturer
- Date
- Page
- Total pages
- Size page
- A3
- Open Hardware Project
- Materials
- (in symbol PLD-6) Конт.; Цепь

### Library data of the parts
C28 C30 C31 = Ceramic_0805: as C1 on sheet Main MCU. Page 1; Package: 0805; HelpURL: https://www.digikey.com/product-detail/en/yageo/CC0805KRX7R7BB104/311-1142-1-ND/303052; Temperature: -55...+125°C
C29 C32 = Ceramic_0805: as C12 on sheet Main MCU. Page 1; Package: 0805; HelpURL: https://www.digikey.com/product-detail/en/yageo/CC0805KRX7R9BB103/311-1136-1-ND/303046; Temperature: -55...+125°C
D17 D18 = SN74AUP2G08DCUR: as D3 on sheet Protection channel A. Page 2; HelpURL: https://www.digikey.com/product-detail/en/texas-instruments/SN74AUP2G08DCUR/296-32271-1-ND/3505517; Package: 8-VSSOP; ComponentType: IC logic AND; Temperature: -40...+855°C; PartNumber: SN74AUP2G08DCUR
D19 = SN74LVC2G34DBVR: as D5 on sheet Protection channel A. Page 2; HelpURL: https://www.digikey.com/product-detail/en/texas-instruments/SN74LVC2G34DBVR/296-13496-1-ND/486431; Package: SOT23-6; ComponentType: IC logic buffer; Temperature: -40...+125°C; PartNumber: SN74LVC2G34DBVR
D20 = SN74LVC1G86DBVR: as D6 on sheet Protection channel A. Page 2; HelpURL: https://www.digikey.com/product-detail/en/texas-instruments/SN74LVC1G86DBVR/296-9853-1-ND/380077; Package: SOT23-5; ComponentType: IC logic XOR; Temperature: -40...+125°C; PartNumber: SN74LVC1G86DBVR
D21 = SN74AUP1G74DCUR: as D7 on sheet Protection channel A. Page 2; HelpURL: https://www.digikey.com/product-detail/en/texas-instruments/SN74AUP1G74DCUR/296-19761-1-ND/1091423; Package: 8-VSSOP; ComponentType: ICtrigger D-type; Temperature: -40...+85°C; PartNumber: SN74AUP1G74DCUR
D22 = SN74AUP1G17DBVR: as D8 on sheet Protection channel A. Page 2; HelpURL: https://www.digikey.com/product-detail/en/texas-instruments/SN74AUP1G17DBVR/296-19077-1-ND/864308; Package: SOT23-6; ComponentType: IC Schmitt trigger; Temperature: -40...+85°C; PartNumber: SN74AUP1G17DBVR
R36 R37 R39 R41 = Resistor_0805: as R4 on sheet Main MCU. Page 1; Package: 0805; HelpURL: https://www.digikey.com/product-detail/en/yageo/RC0805JR-0710KL/311-10KARCT-ND/731188; Temperature: -55...+125°C
R38 R42 = Resistor_0805: as R3 on sheet Main MCU. Page 1; Package: 0805; HelpURL: https://www.digikey.com/product-detail/en/yageo/RC0805JR-07100RL/311-100ARCT-ND/731185; Temperature: -55...+125°C
R40 = Resistor_0805: as R9 on sheet Main MCU. Page 1; Package: 0805; HelpURL: https://www.digikey.com/product-detail/en/yageo/RC0805JR-07470RL/311-470ARCT-ND/731280; Temperature: -55...+125°C
VD15 VD17 = Diode_array: as VD5 on sheet Protection channel A. Page 2; Package: SOT-23; HelpURL: https://www.digikey.com/product-detail/en/diodes-incorporated/BAV199-7-F/BAV199-FDICT-ND/1033647; Temperature: -65...+150°C
VD16 = LED_single: as VD2 on sheet Main MCU. Page 1; Package: 0805; HelpURL: https://www.digikey.com/product-detail/en/wurth-electronics-inc/150080RS75000/732-4984-1-ND/4489916; Temperature: -55...+150°C
X7 = PLD-6: as X2 on sheet Protection channel A. Page 2; HelpURL: https://www.chipdip.ru/product/pld-6; PartNumber: PLD-6

## Sheet Protection channel D. Page 5.SchDoc
size 420 x 297 mm; Address1: Address1; Address2: Address2; Address3: Address3; Address4: Address4; DocumentNumber: АБВГ.123456.001 Э3; SheetNumber: 5; SheetTotal: 7; Scale: 1:1; DocumentType: Схема электрическая принципиальная; FirstReferrence: АБВГ.123456.001
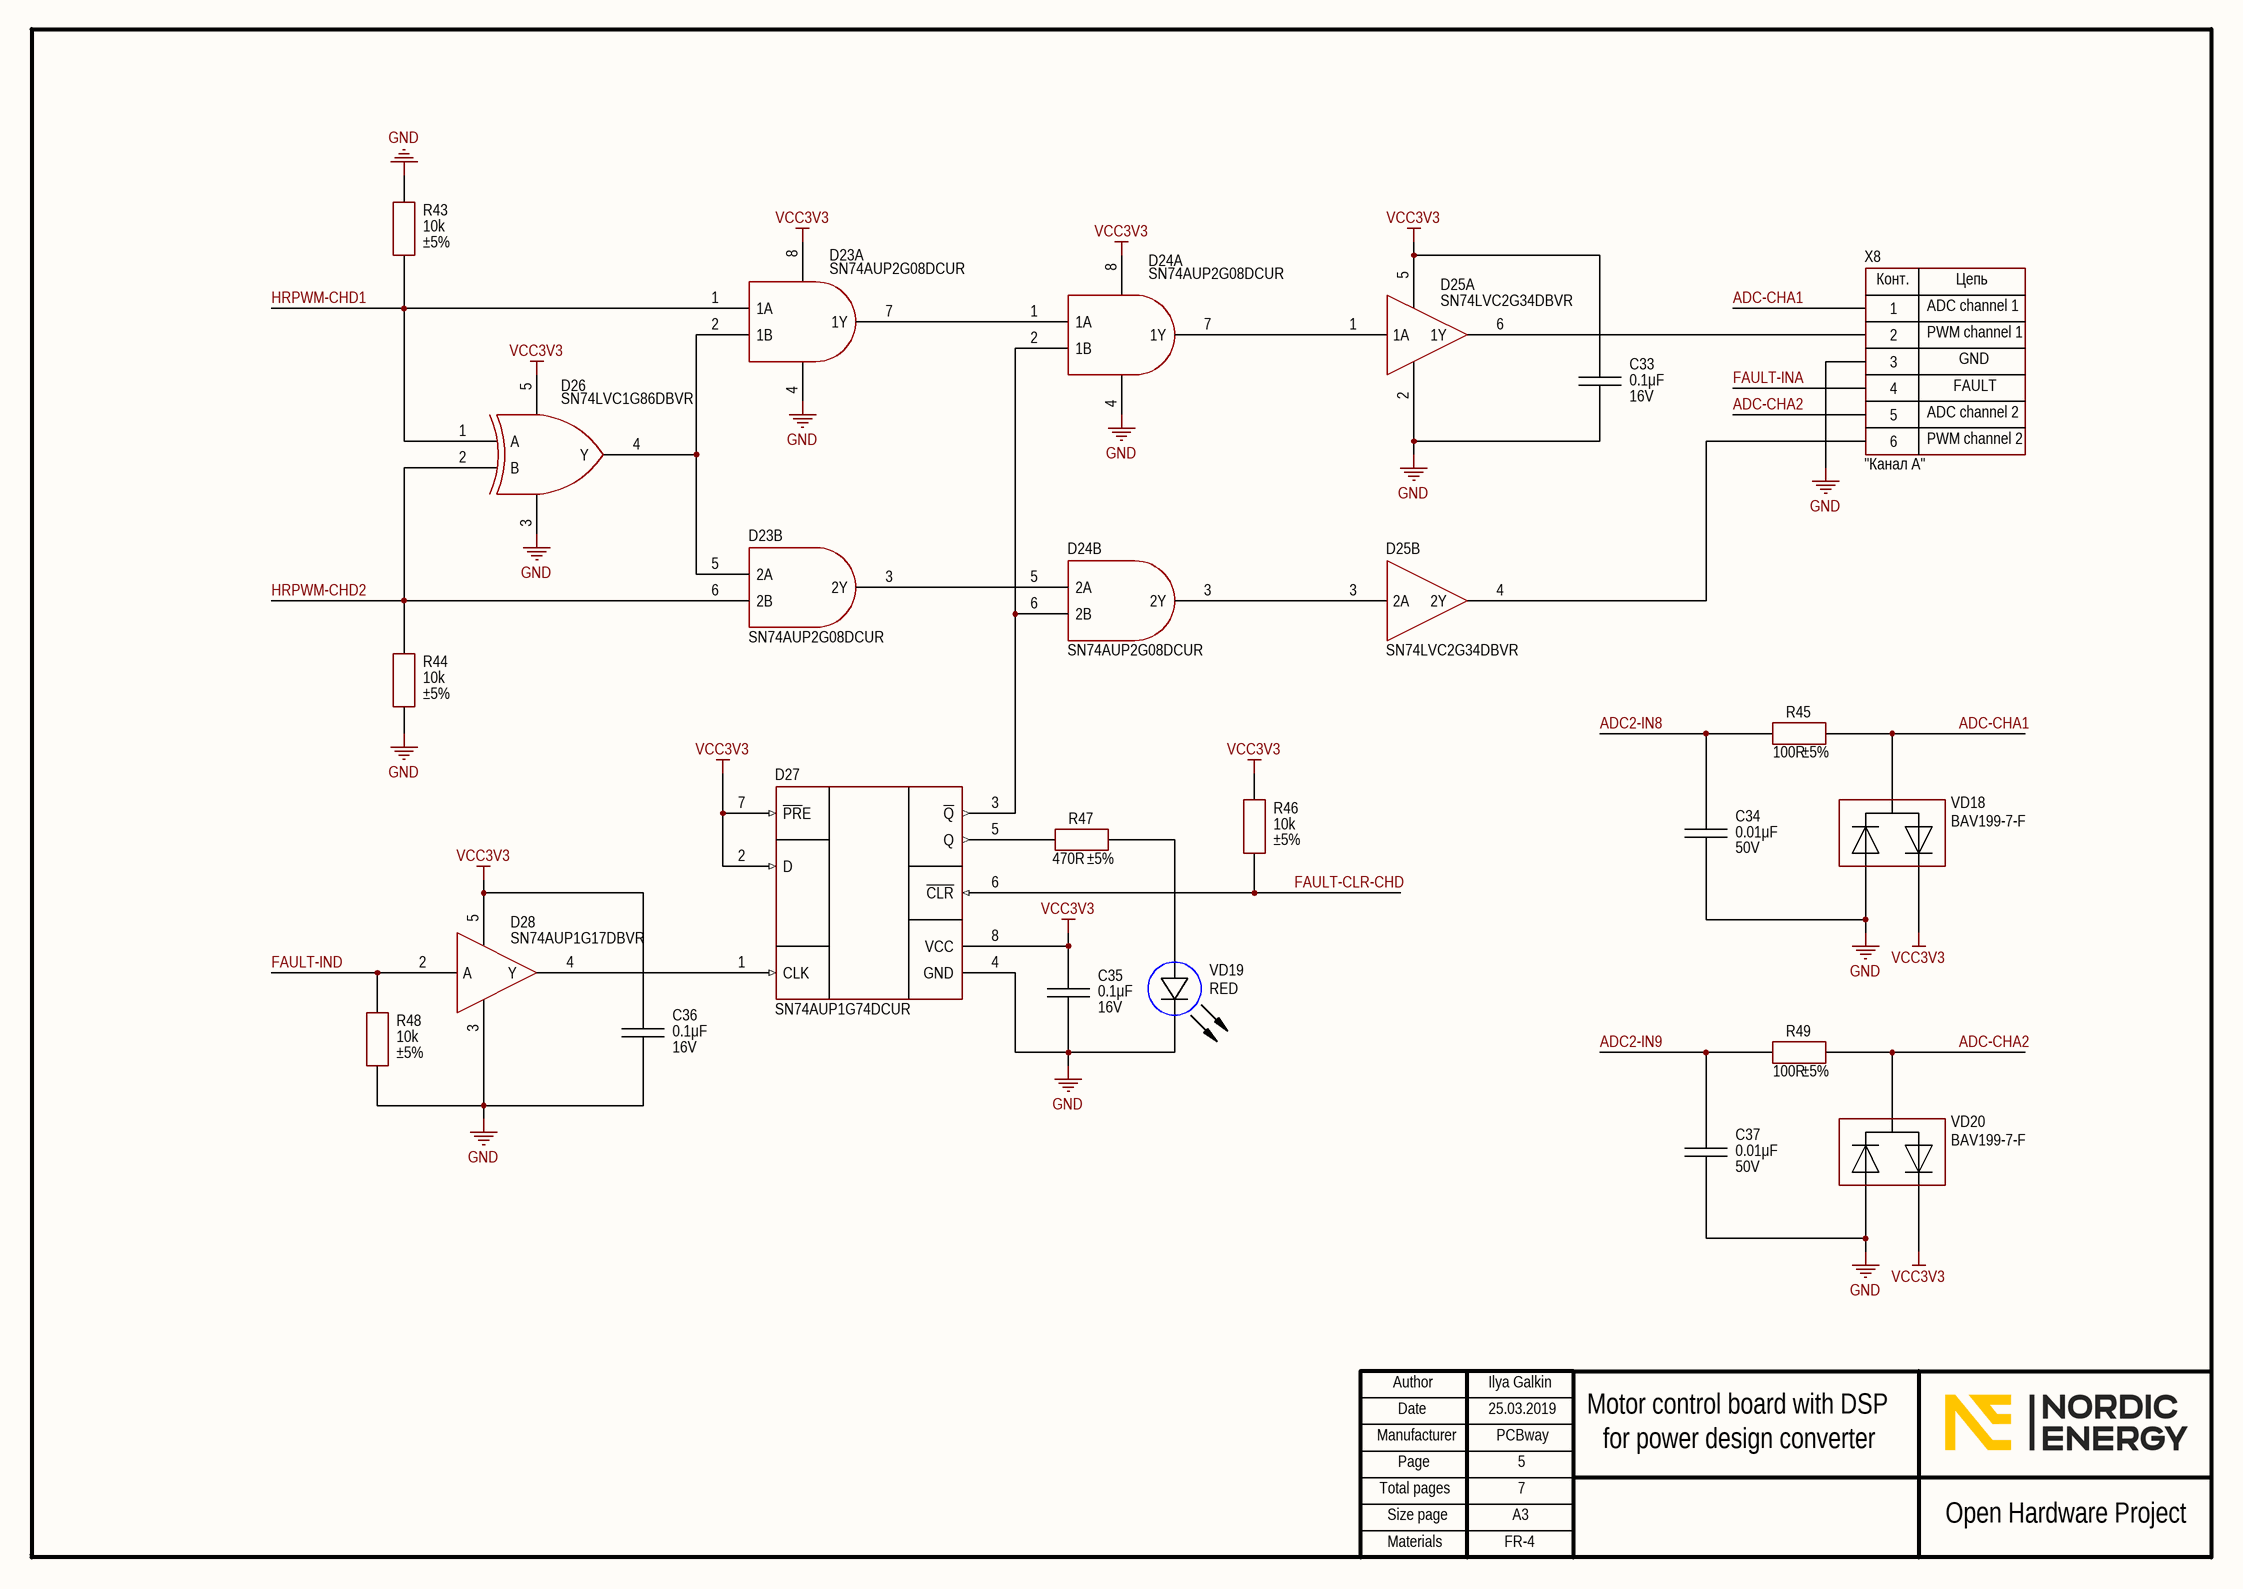
[diagram p4: Protection channel D. Page 5.SchDoc]

### Parts
C33  value 0.1μF  Voltage: 16V  [CAP: 0805]
C34  value 0.01μF  Voltage: 50V  [CAP: 0805]
C35  value 0.1μF  Voltage: 16V  [CAP: 0805]
C36  value 0.1μF  Voltage: 16V  [CAP: 0805]
C37  value 0.01μF  Voltage: 50V  [CAP: 0805]
D23  (no value)  [8-VSSOP]  (parts A,B of 2)
D24  (no value)  [8-VSSOP]  (parts A,B of 2)
D25  (no value)  [SOT23-6]  (parts A,B of 2)
D26  (no value)  [SOT23-5]
D27  (no value)  [8-VSSOP]
D28  (no value)  [SOT23-5]
R43  value 10k  Tolerance: ±5%  [RES: 0805]
R44  value 10k  Tolerance: ±5%  [RES: 0805]
R45  value 100R  Tolerance: ±5%  [RES: 0805]
R46  value 10k  Tolerance: ±5%  [RES: 0805]
R47  value 470R  Tolerance: ±5%  [RES: 0805]
R48  value 10k  Tolerance: ±5%  [RES: 0805]
R49  value 100R  Tolerance: ±5%  [RES: 0805]
VD18  PartNumber: BAV199-7-F  [SOT23]
VD19  Color: RED  [LED: 0805R]
VD20  PartNumber: BAV199-7-F  [SOT23]
X8  CommentText: "Канал А"  [CON: PLD-6]

### Nets
GND: C33.1 C34.1 C35.1 C36.1 C37.1 D23.4 D24.4 D25.2 D26.3 D27.4(GND) D28.3 R43.1 R44.2 R48.2 VD18.1 VD19.2(C) VD20.1 X8.3
VCC3V3: C33.2 C35.2 C36.2 D23.8 D24.8 D25.5 D26.5 D27.2(D) D27.7(~{PR}E) D27.8(VCC) D28.5 R46.1 VD18.2 VD20.2
ADC2-IN8: C34.2 R45.1
ADC2-IN9: C37.2 R49.1
ADC-CHA1: R45.2 VD18.3 X8.1
ADC-CHA2: R49.2 VD20.3 X8.5
FAULT-CLR-CHD: D27.6(~{CLR}) R46.2
FAULT-INA: X8.4
FAULT-IND: D28.2(A) R48.1
HRPWM-CHD1: D23.1(1A) D26.1(A) R43.2
HRPWM-CHD2: D23.6(2B) D26.2(B) R44.1
NetD23_2: D23.2(1B) D23.5(2A) D26.4(Y)
NetD23_3: D23.3(2Y) D24.5(2A)
NetD23_7: D23.7(1Y) D24.1(1A)
NetD24_2: D24.2(1B) D24.6(2B) D27.3(~{Q})
NetD24_3: D24.3(2Y) D25.3(2A)
NetD24_7: D24.7(1Y) D25.1(1A)
NetD25_4: D25.4(2Y) X8.6
NetD25_6: D25.6(1Y) X8.2
NetD27_1: D27.1(CLK) D28.4(Y)
NetD27_5: D27.5(Q) R47.2
NetR47_1: R47.1 VD19.1(A)

### Notes on the sheet
- ADC channel 1
- PWM channel 1
- FAULT
- GND
- ADC channel 2
- PWM channel 2
- Ilya Galkin
- 25.03.2019
- PCBway
- 5
- Motor control board with DSP
- for power design converter
- 7
- FR-4
- Author
- Manufacturer
- Date
- Page
- Total pages
- Size page
- A3
- Open Hardware Project
- Materials
- (in symbol PLD-6) Конт.; Цепь

### Library data of the parts
C33 C35 C36 = Ceramic_0805: as C1 on sheet Main MCU. Page 1; Package: 0805; HelpURL: https://www.digikey.com/product-detail/en/yageo/CC0805KRX7R7BB104/311-1142-1-ND/303052; Temperature: -55...+125°C
C34 C37 = Ceramic_0805: as C12 on sheet Main MCU. Page 1; Package: 0805; HelpURL: https://www.digikey.com/product-detail/en/yageo/CC0805KRX7R9BB103/311-1136-1-ND/303046; Temperature: -55...+125°C
D23 D24 = SN74AUP2G08DCUR: as D3 on sheet Protection channel A. Page 2; HelpURL: https://www.digikey.com/product-detail/en/texas-instruments/SN74AUP2G08DCUR/296-32271-1-ND/3505517; Package: 8-VSSOP; ComponentType: IC logic AND; Temperature: -40...+855°C; PartNumber: SN74AUP2G08DCUR
D25 = SN74LVC2G34DBVR: as D5 on sheet Protection channel A. Page 2; HelpURL: https://www.digikey.com/product-detail/en/texas-instruments/SN74LVC2G34DBVR/296-13496-1-ND/486431; Package: SOT23-6; ComponentType: IC logic buffer; Temperature: -40...+125°C; PartNumber: SN74LVC2G34DBVR
D26 = SN74LVC1G86DBVR: as D6 on sheet Protection channel A. Page 2; HelpURL: https://www.digikey.com/product-detail/en/texas-instruments/SN74LVC1G86DBVR/296-9853-1-ND/380077; Package: SOT23-5; ComponentType: IC logic XOR; Temperature: -40...+125°C; PartNumber: SN74LVC1G86DBVR
D27 = SN74AUP1G74DCUR: as D7 on sheet Protection channel A. Page 2; HelpURL: https://www.digikey.com/product-detail/en/texas-instruments/SN74AUP1G74DCUR/296-19761-1-ND/1091423; Package: 8-VSSOP; ComponentType: ICtrigger D-type; Temperature: -40...+85°C; PartNumber: SN74AUP1G74DCUR
D28 = SN74AUP1G17DBVR: as D8 on sheet Protection channel A. Page 2; HelpURL: https://www.digikey.com/product-detail/en/texas-instruments/SN74AUP1G17DBVR/296-19077-1-ND/864308; Package: SOT23-6; ComponentType: IC Schmitt trigger; Temperature: -40...+85°C; PartNumber: SN74AUP1G17DBVR
R43 R44 R46 R48 = Resistor_0805: as R4 on sheet Main MCU. Page 1; Package: 0805; HelpURL: https://www.digikey.com/product-detail/en/yageo/RC0805JR-0710KL/311-10KARCT-ND/731188; Temperature: -55...+125°C
R45 R49 = Resistor_0805: as R3 on sheet Main MCU. Page 1; Package: 0805; HelpURL: https://www.digikey.com/product-detail/en/yageo/RC0805JR-07100RL/311-100ARCT-ND/731185; Temperature: -55...+125°C
R47 = Resistor_0805: as R9 on sheet Main MCU. Page 1; Package: 0805; HelpURL: https://www.digikey.com/product-detail/en/yageo/RC0805JR-07470RL/311-470ARCT-ND/731280; Temperature: -55...+125°C
VD18 VD20 = Diode_array: as VD5 on sheet Protection channel A. Page 2; Package: SOT-23; HelpURL: https://www.digikey.com/product-detail/en/diodes-incorporated/BAV199-7-F/BAV199-FDICT-ND/1033647; Temperature: -65...+150°C
VD19 = LED_single: as VD2 on sheet Main MCU. Page 1; Package: 0805; HelpURL: https://www.digikey.com/product-detail/en/wurth-electronics-inc/150080RS75000/732-4984-1-ND/4489916; Temperature: -55...+150°C
X8 = PLD-6: as X2 on sheet Protection channel A. Page 2; HelpURL: https://www.chipdip.ru/product/pld-6; PartNumber: PLD-6

## Sheet USB and CAN. Page 6.SchDoc
size 420 x 297 mm; Address1: Address1; Address2: Address2; Address3: Address3; Address4: Address4; DocumentNumber: АБВГ.123456.001 Э3; SheetNumber: 6; SheetTotal: 7; Scale: 1:1; DocumentType: Схема электрическая принципиальная; FirstReferrence: АБВГ.123456.001
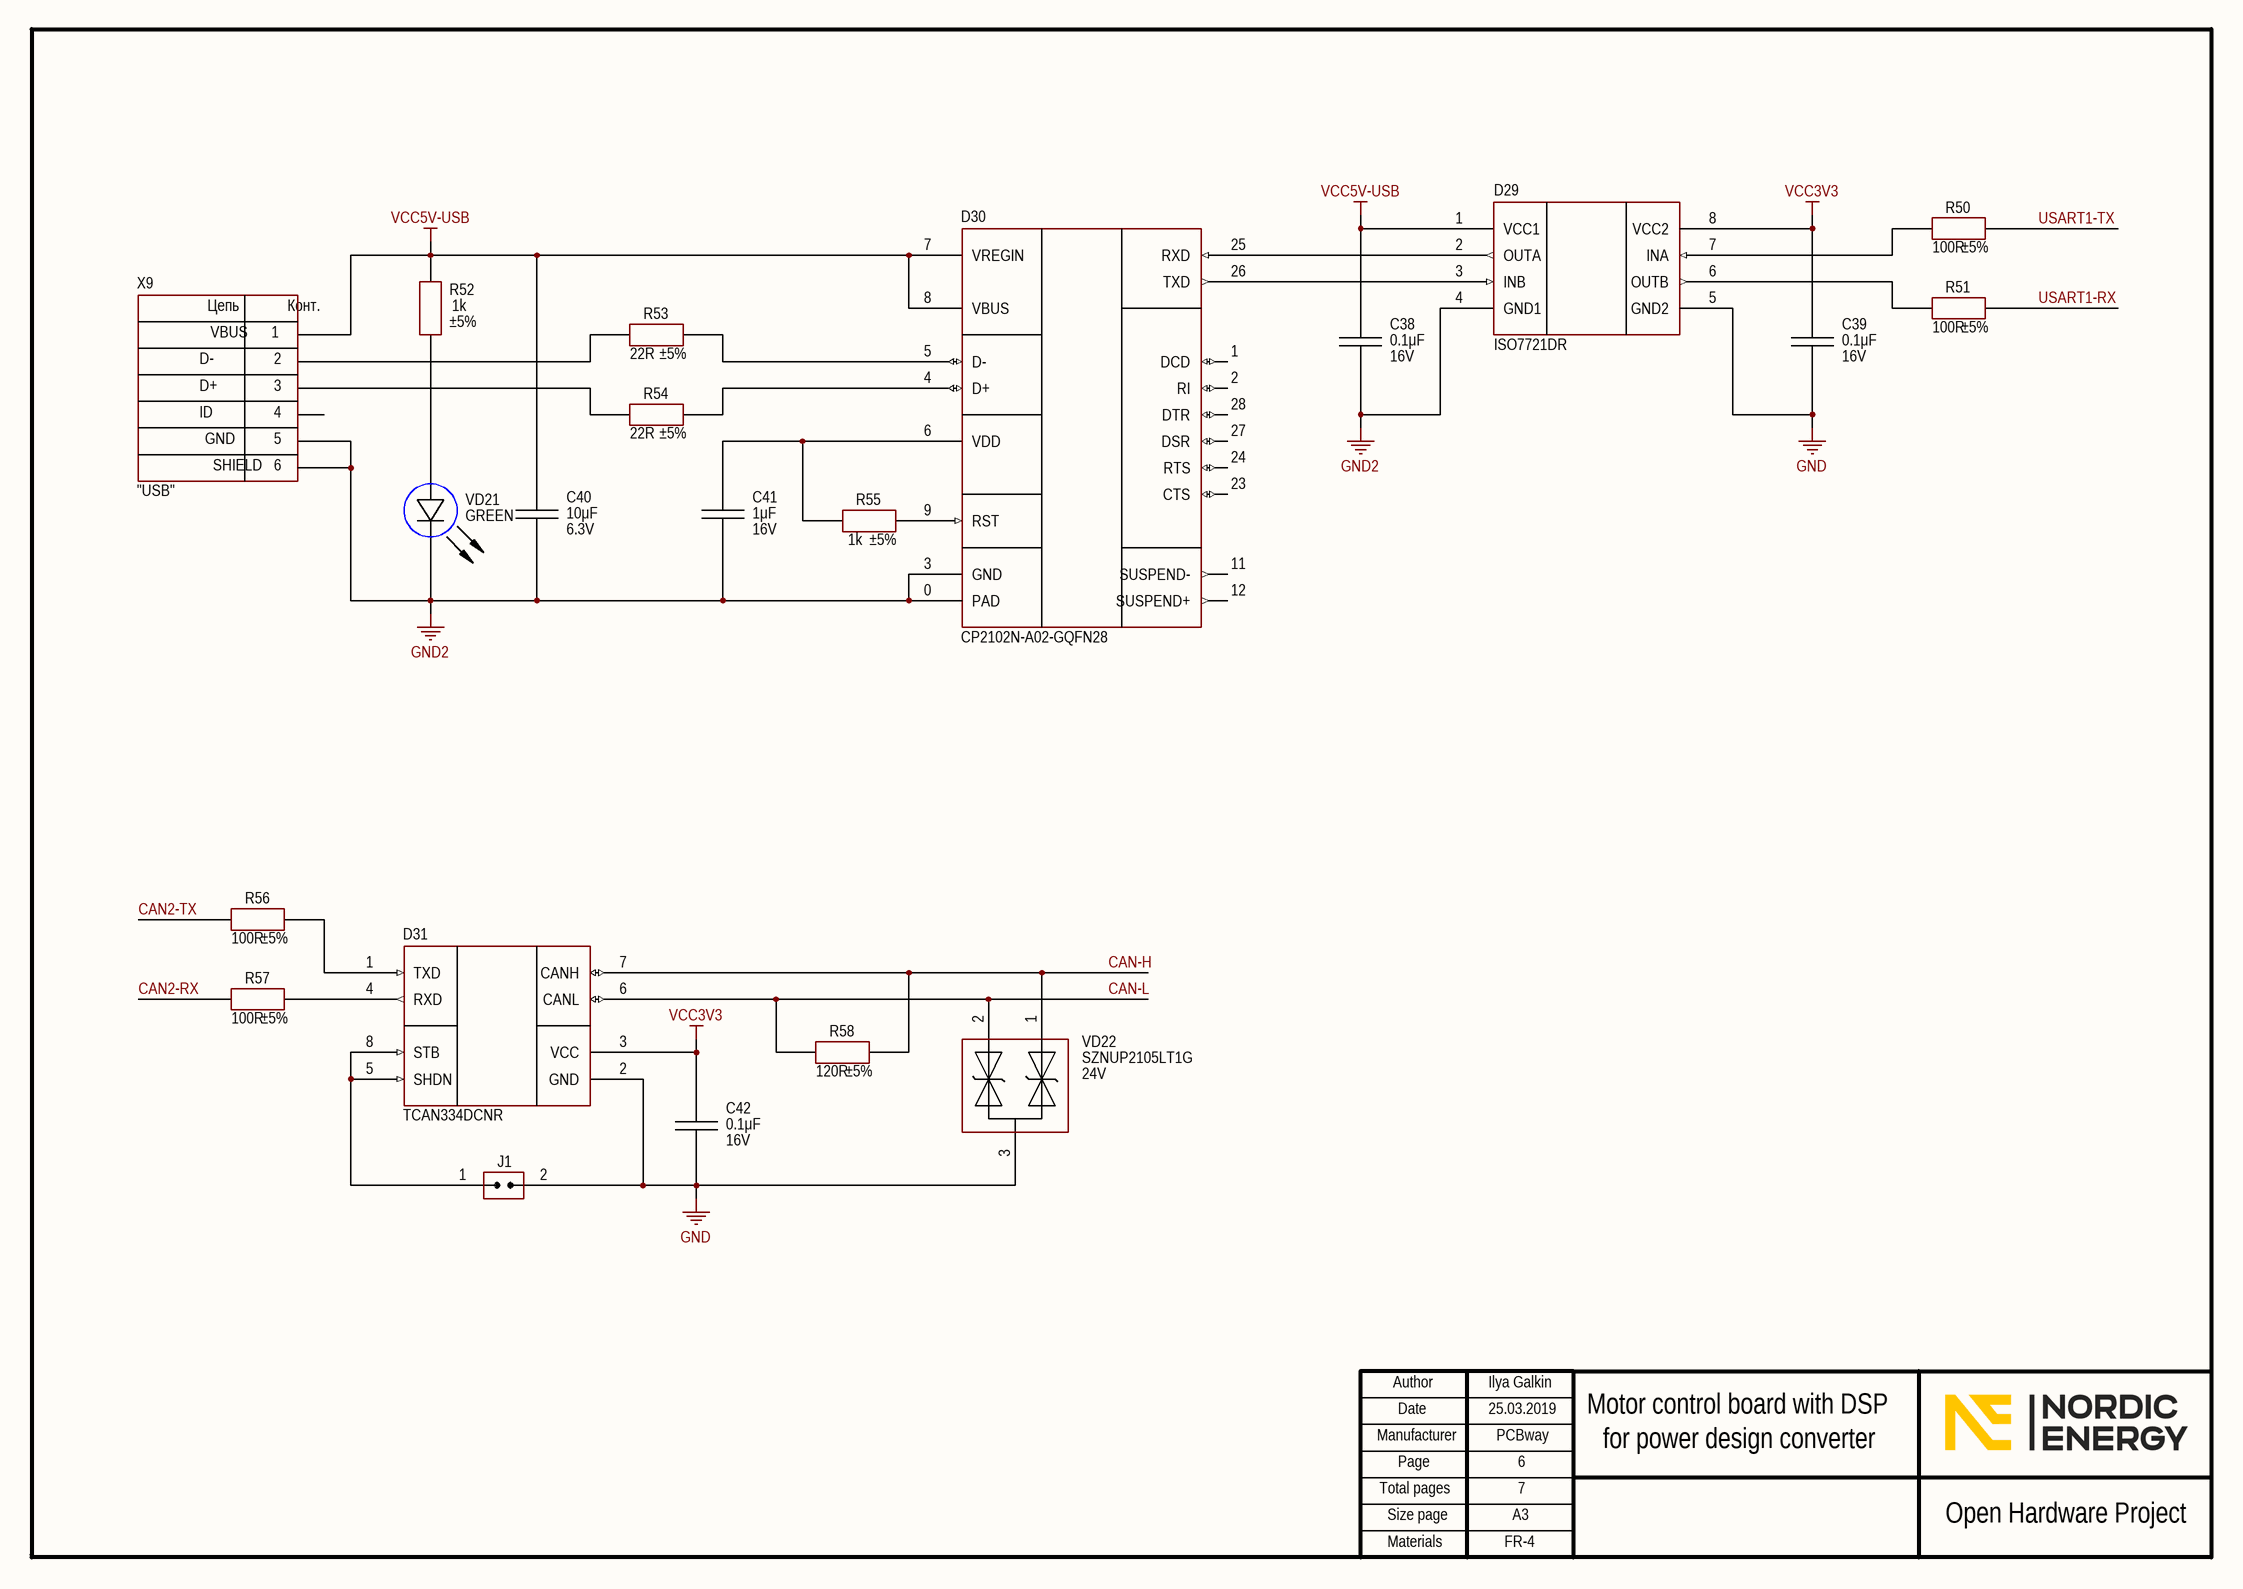
[diagram p5: USB and CAN. Page 6.SchDoc]

### Parts
C38  value 0.1μF  Voltage: 16V  [CAP: 0805]
C39  value 0.1μF  Voltage: 16V  [CAP: 0805]
C40  value 10μF  Voltage: 6.3V  [CAP: 0805]
C41  value 1μF  Voltage: 16V  [CAP: 0805]
C42  value 0.1μF  Voltage: 16V  [CAP: 0805]
D29  (no value)  [8-SOIC]
D30  PartNumber: CP2102N-A02-GQFN28  [28-QFN (5x5)]
D31  (no value)  [SOT23-8]
J1  (no value)  [CON: JUMPER x1]
R50  value 100R  Tolerance: ±5%  [RES: 0805]
R51  value 100R  Tolerance: ±5%  [RES: 0805]
R52  value 1k  Tolerance: ±5%  [RES: 0805]
R53  value 22R  Tolerance: ±5%  [RES: 0805]
R54  value 22R  Tolerance: ±5%  [RES: 0805]
R55  value 1k  Tolerance: ±5%  [RES: 0805]
R56  value 100R  Tolerance: ±5%  [RES: 0805]
R57  value 100R  Tolerance: ±5%  [RES: 0805]
R58  value 120R  Tolerance: ±5%  [RES: 0805]
VD21  Color: GREEN  [LED: 0603G]
VD22  Voltage: 24V  PartNumber: SZNUP2105LT1G  [SOT23]
X9  CommentText: "USB"  [CON: USB micro-A (ZX62-B-5PA)]

### Nets
GND: C39.1 C42.1 D29.5(GND2) D31.2(GND) J1.2(IN) VD22.3
GND2: C38.1 C40.1 C41.1 D29.4(GND1) D30.0(PAD) D30.3(GND) VD21.2(C) X9.0 X9.5
VCC3V3: C39.2 C42.2 D29.8(VCC2) D31.3(VCC)
VCC5V-USB: C38.2 C40.2 D29.1(VCC1) D30.7(VREGIN) D30.8(VBUS) R52.2 X9.1
CAN2-RX: R57.1
CAN2-TX: R56.1
CAN-H: D31.7(CANH) R58.2 VD22.1
CAN-L: D31.6(CANL) R58.1 VD22.2
USART1-RX: R51.2
USART1-TX: R50.2
NetC41_2: C41.2 D30.6(VDD) R55.2
NetD29_2: D29.2(OUTA) D30.25(RXD)
NetD29_3: D29.3(INB) D30.26(TXD)
NetD29_6: D29.6(OUTB) R51.1
NetD29_7: D29.7(INA) R50.1
NetD30_4: D30.4(D+) R54.2
NetD30_5: D30.5(D-) R53.2
NetD30_9: D30.9(RST) R55.1
NetD31_1: D31.1(TXD) R56.2
NetD31_4: D31.4(RXD) R57.2
NetD31_5: D31.5(SHDN) D31.8(STB) J1.1(IN)
NetR52_1: R52.1 VD21.1(A)
NetR53_1: R53.1 X9.2
NetR54_1: R54.1 X9.3

Not connected (* = marked no-connect by the designer): D30 1(DCD) 2(RI) 11(SUSPEND-) 12(SUSPEND+) 23(CTS) 24(RTS) 27(DSR) 28(DTR); X9 4

### Notes on the sheet
- Ilya Galkin
- 25.03.2019
- PCBway
- 6
- Motor control board with DSP
- for power design converter
- 7
- FR-4
- Author
- Manufacturer
- Date
- Page
- Total pages
- Size page
- A3
- Open Hardware Project
- Materials
- (in symbol Connector_USB_micro_B) Цепь; Конт.; VBUS; D-; D+; ID; GND; SHIELD; 6

### Library data of the parts
C38 C39 C42 = Ceramic_0805: as C1 on sheet Main MCU. Page 1; Package: 0805; HelpURL: https://www.digikey.com/product-detail/en/yageo/CC0805KRX7R7BB104/311-1142-1-ND/303052; Temperature: -55...+125°C
C40 = Ceramic_0805: Manufacturer: Samsung; PartNumber: CL21B106KQQNNNE; ValueManufacturerPartNumber: Ceramic capacitor, 10μF, X7R, ±10%, 6.3V, 0805, -55...+125°C; TypeCapacitor: Ceramic capacitor; Tolerance: ±10%; TypeDielectric: X7R; Package: 0805; HelpURL: https://www.digikey.com/product-detail/en/samsung-electro-mechanics/CL21B106KQQNNNE/1276-1113-1-ND/3889199; Temperature: -55...+125°C
C41 = Ceramic_0805: as C2 on sheet Main MCU. Page 1; Package: 0805; HelpURL: https://www.digikey.com/product-detail/en/yageo/CC0805KKX7R7BB105/311-1365-1-ND/2103149; Temperature: -55...+125°C
D29 = ISO7721DR: Digital isolator; Manufacturer: Texas Instruments; ValueManufacturerPartNumber: IC digital isolator, 100Mbps, 3000Vrms, 2.25...5.5V, -55...+125°C, 8-SOIC; Supply: 2.25...5.5V; DataRate: 100Mbps; Isolation: 3000Vrms; HelpURL: https://www.digikey.com/product-detail/en/texas-instruments/ISO7721DR/296-48296-1-ND/8347715; Package: 8-SOIC; ComponentType: IC digital isolator; Temperature: -55...+125°C; PartNumber: ISO7721DR
D30 = CP2102N: USB-to-UART; Manufacturer: Silicon Labs; ValueManufacturerPartNumber: IC usb-to-uart bridge, USB2.0, 3...3.6V, -40...+85°C, 28-VFQFN; Supply: 3...3.6V; HelpURL: https://www.digikey.com/product-detail/en/silicon-labs/CP2102N-A02-GQFN28/336-5889-ND/9863477; Package: 28-VFQFN; ComponentType: IC usb-to-uart bridge; Temperature: -40...+85°C; Standard: USB2.0
D31 = TCAN334DCNR: CAN; Manufacturer: Texas Instruments; ValueManufacturerPartNumber: IC CAN transceiver, 1Mbps, Half-duplex, 3...3.6V, -40...+125°C, SOT23-8; Supply: 3...3.6V; DataRate: 1Mbps; TypeDuplex: Half-duplex; HelpURL: https://www.digikey.com/product-detail/en/texas-instruments/TCAN334DCNR/296-47830-1-ND/8133179; Package: SOT23-8; ComponentType: IC CAN transceiver; Temperature: -40...+125°C; PartNumber: TCAN334DCNR
J1 = Jumper_single: CommentText: "Перемычка"
R50 R51 R56 R57 = Resistor_0805: as R3 on sheet Main MCU. Page 1; Package: 0805; HelpURL: https://www.digikey.com/product-detail/en/yageo/RC0805JR-07100RL/311-100ARCT-ND/731185; Temperature: -55...+125°C
R52 R55 = Resistor_0805: Manufacturer: Yageo; PartNumber: RC0805JR-071KL; ValueManufacturerPartNumber: Resistor film, 1k, ±5%, 0805, 0.125W, -55...+125°C; TypeResistor: Resistor film; Power: 0.125W; Package: 0805; HelpURL: https://www.digikey.com/product-detail/en/yageo/RC0805JR-071KL/311-1.0KARCT-ND/731165; Temperature: -55...+125°C
R53 R54 = Resistor_0805: Manufacturer: Yageo; PartNumber: RC0805JR-0722RL; ValueManufacturerPartNumber: Resistor film, 22R, ±5%, 0805, 0.125W, -55...+125°C; TypeResistor: Resistor film; Power: 0.125W; Package: 0805; HelpURL: https://www.digikey.com/product-detail/en/yageo/RC0805JR-0722RL/311-22ARCT-ND/731232; Temperature: -55...+125°C
R58 = Resistor_0805: Manufacturer: Yageo; PartNumber: RC0805JR-07120RL; ValueManufacturerPartNumber: Resistor film, 120R, ±5%, 0805, 0.125W, -55...+125°C; TypeResistor: Resistor film; Power: 0.125W; Package: 0805; HelpURL: https://www.digikey.com/product-detail/en/yageo/RC0805JR-07120RL/311-120ARCT-ND/731194; Temperature: -55...+125°C
VD21 = LED_single: as VD3 on sheet Main MCU. Page 1; Package: 0805; HelpURL: https://www.digikey.com/product-detail/en/wurth-electronics-inc/150080VS75000/732-4986-1-ND/4489922; Temperature: -55...+150°C
VD22 = TVS_array: Manufacturer: ON Semiconductor; ValueManufacturerPartNumber: Zener diode, 24V, 350W peak, 30pF, 17Ohm, SOT-23, -55...+150°C; TypeDiode: Zener diode; Current: 350W peak; VoltageDrop: 30pF; RecoveryTime: 17Ohm; Package: SOT-23; HelpURL: https://www.digikey.com/product-detail/en/on-semiconductor/SZNUP2105LT1G/SZNUP2105LT1GOSCT-ND/3487669; Temperature: -55...+150°C
X9 = Connector_USB_micro_B: Manufacturer: Hirose Electric; ValueManufacturerPartNumber: USB micro B; PartNumber: ZX62-B-5PA; HelpURL: https://www.digikey.com/product-detail/en/hirose-electric-co-ltd/ZX62-B-5PA/H11579CT-ND/1851090; TypeConnector: USB micro B

## Sheet Power and system. Page 7.SchDoc
size 420 x 297 mm; Address1: Address1; Address2: Address2; Address3: Address3; Address4: Address4; DocumentNumber: АБВГ.123456.001 Э3; SheetNumber: 7; SheetTotal: 7; Scale: 1:1; DocumentType: Схема электрическая принципиальная; FirstReferrence: АБВГ.123456.001
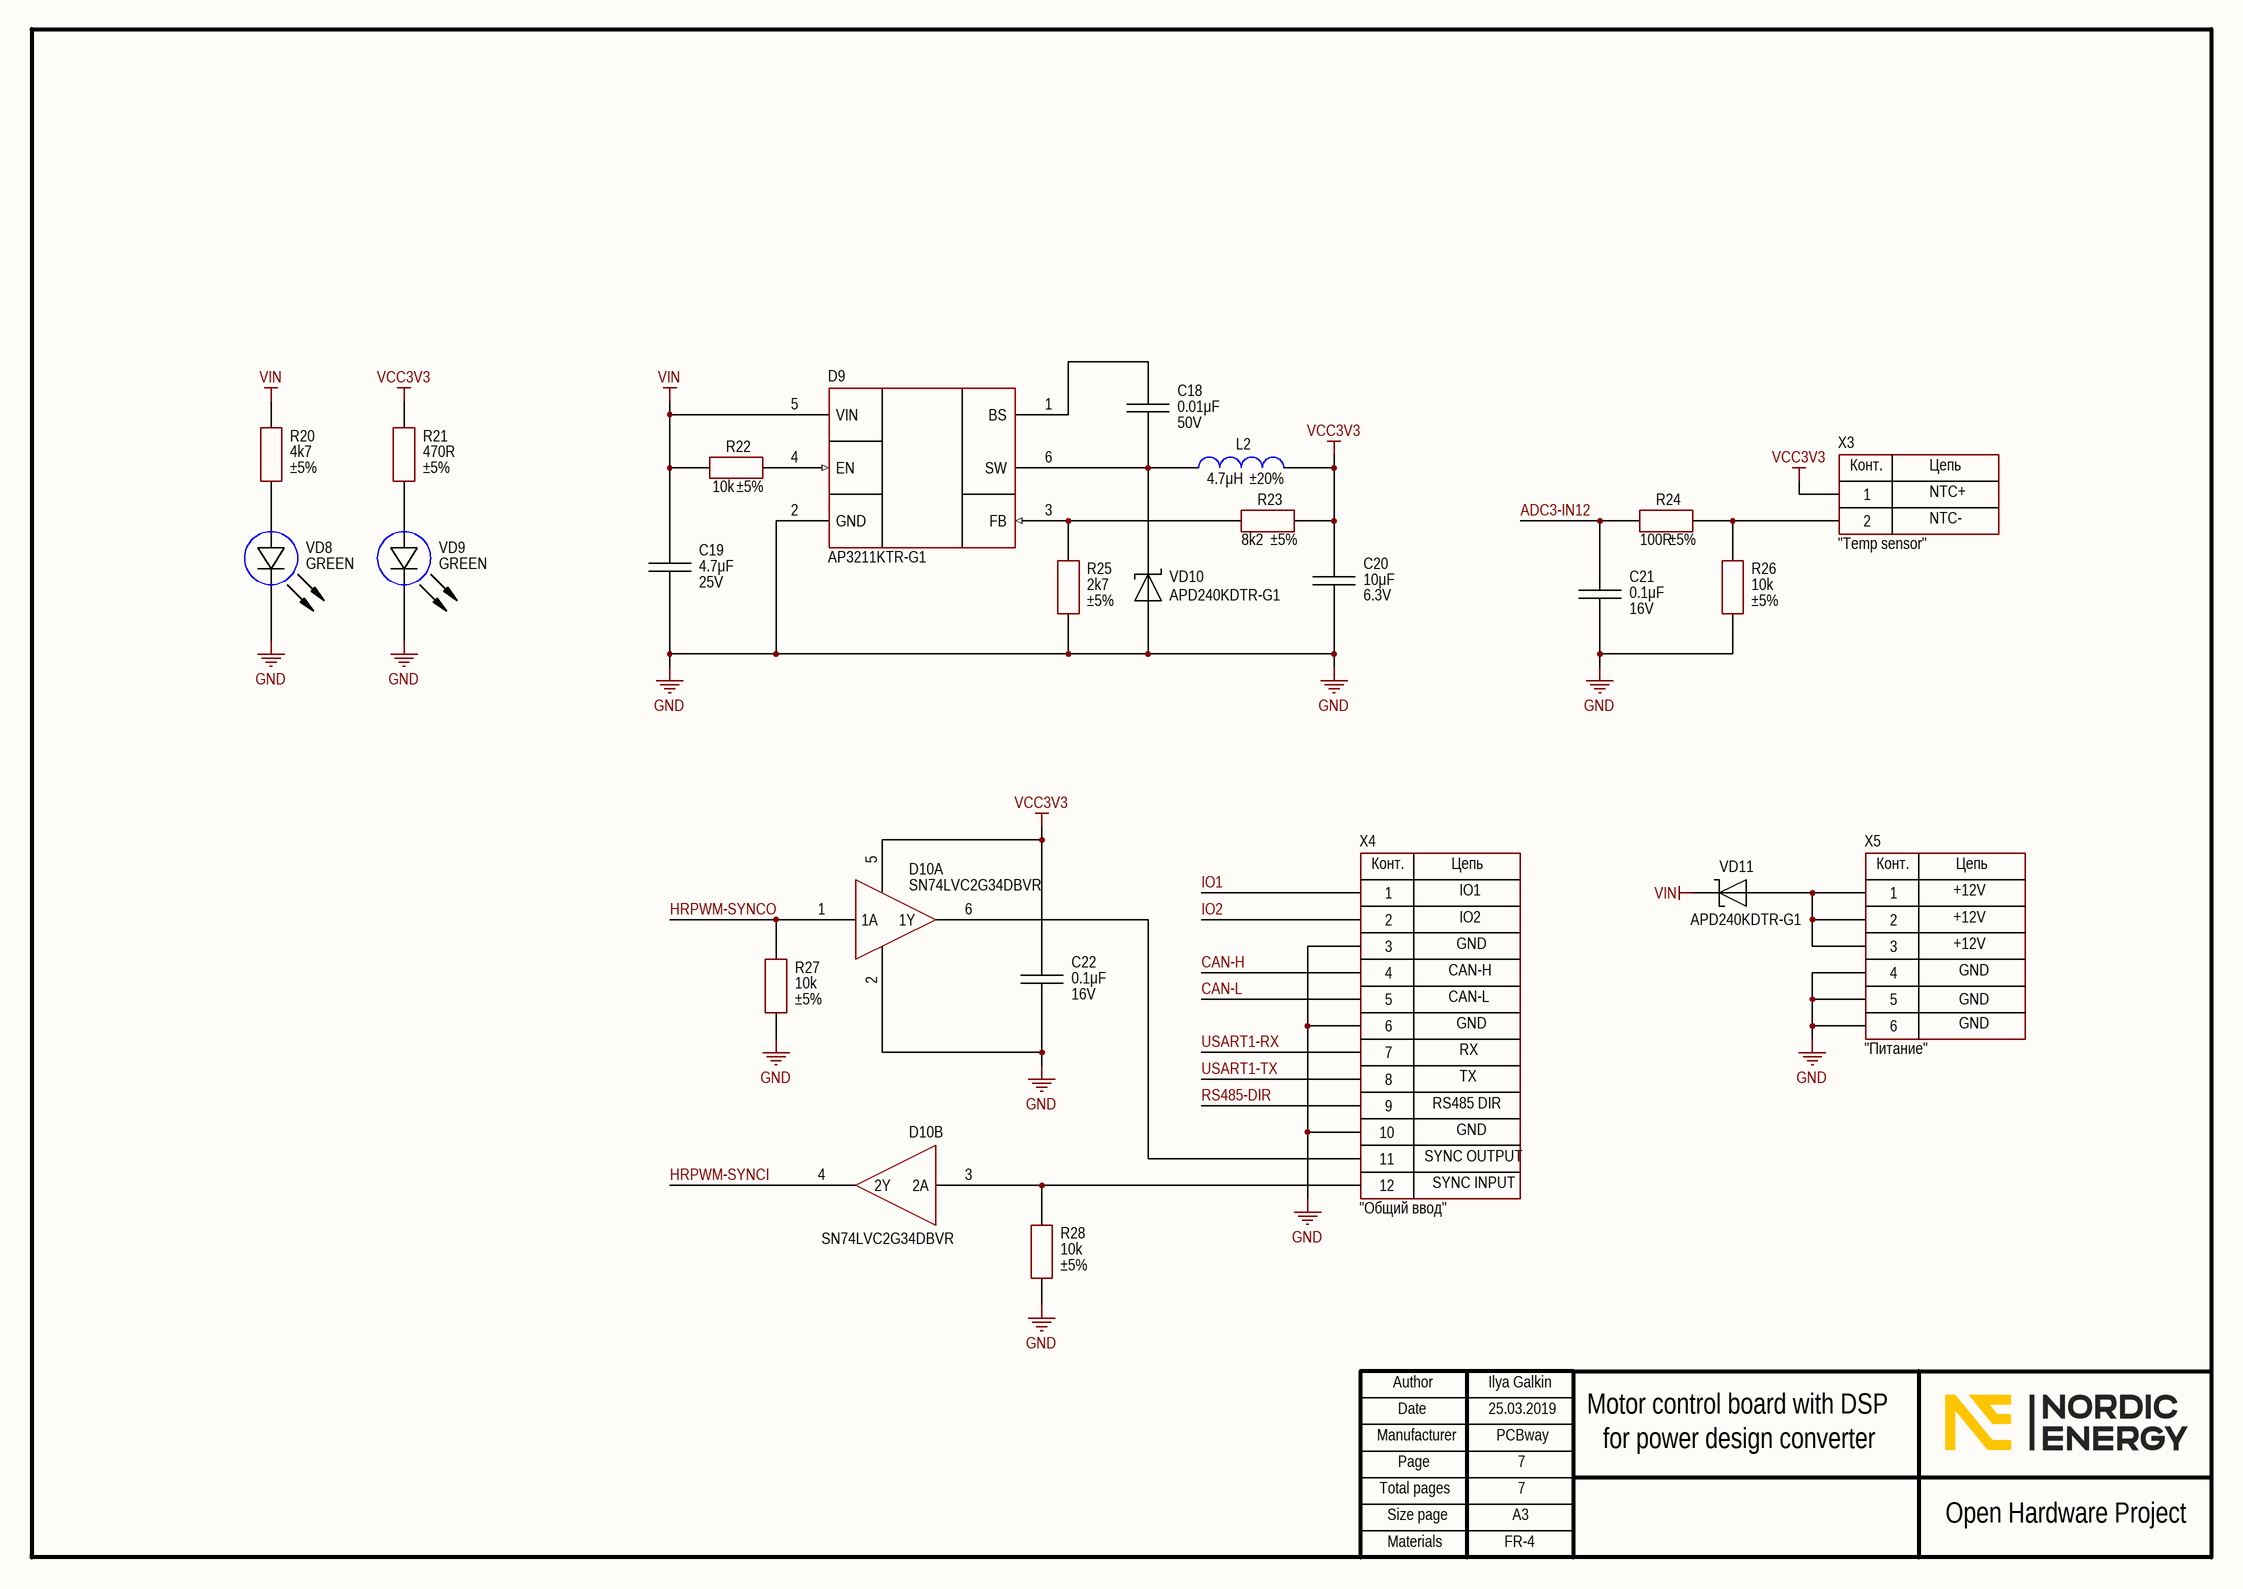
[diagram p6: Power and system. Page 7.SchDoc]

### Parts
C18  value 0.01μF  Voltage: 50V  [CAP: 0805]
C19  value 4.7μF  Voltage: 25V  [CAP: 0805]
C20  value 10μF  Voltage: 6.3V  [CAP: 0805]
C21  value 0.1μF  Voltage: 16V  [CAP: 0805]
C22  value 0.1μF  Voltage: 16V  [CAP: 0805]
D9  (no value)  [SOT23-6]
D10  (no value)  [SOT23-6]  (parts A,B of 2)
L2  value 4.7μH  Tolerance: ±20%  [IND: SRP2510A]
R20  value 4k7  Tolerance: ±5%  [RES: 0805]
R21  value 470R  Tolerance: ±5%  [RES: 0805]
R22  value 10k  Tolerance: ±5%  [RES: 0805]
R23  value 8k2  Tolerance: ±5%  [RES: 0805]
R24  value 100R  Tolerance: ±5%  [RES: 0805]
R25  value 2k7  Tolerance: ±5%  [RES: 0805]
R26  value 10k  Tolerance: ±5%  [RES: 0805]
R27  value 10k  Tolerance: ±5%  [RES: 0805]
R28  value 10k  Tolerance: ±5%  [RES: 0805]
VD8  Color: GREEN  [LED: 0603G]
VD9  Color: GREEN  [LED: 0603G]
VD10  PartNumber: APD240KDTR-G1  [DIODE: SOD123]
VD11  PartNumber: APD240KDTR-G1  [DIODE: SOD123]
X3  CommentText: "Temp sensor"  [CON: PLS-2]
X4  CommentText: "Общий ввод"  [CON: PBD-12]
X5  CommentText: "Питание"  [CON: PLD-6]

### Nets
GND: C19.1 C20.1 C21.1 C22.1 D9.2(GND) D10.2 R25.1 R26.1 R27.2 R28.2 VD8.2(C) VD9.2(C) VD10.1 X4.3 X4.6 X4.10 X5.4 X5.5 X5.6
VCC3V3: C20.2 C22.2 D10.5 L2.1 R21.2 R23.2 X3.1
VIN: C19.2 D9.5(VIN) R20.1 R22.1 VD11.2
ADC3-IN12: C21.2 R24.1
CAN-H: X4.4
CAN-L: X4.5
HRPWM-SYNCI: D10.4(2Y)
HRPWM-SYNCO: D10.1(1A) R27.1
IO1: X4.1
IO2: X4.2
RS485-DIR: X4.9
USART1-RX: X4.7
USART1-TX: X4.8
NetC18_1: C18.1 D9.6(SW) L2.2 VD10.2
NetC18_2: C18.2 D9.1(BS)
NetD9_3: D9.3(FB) R23.1 R25.2
NetD9_4: D9.4(EN) R22.2
NetD10_3: D10.3(2A) R28.1 X4.12
NetD10_6: D10.6(1Y) X4.11
NetR20_2: R20.2 VD8.1(A)
NetR21_1: R21.1 VD9.1(A)
NetR24_2: R24.2 R26.2 X3.2
NetVD11_1: VD11.1 X5.1 X5.2 X5.3

### Notes on the sheet
- NTC+
- NTC-
- IO1
- IO2
- +12V
- CAN-L
- CAN-H
- GND
- RX
- RS485 DIR
- TX
- SYNC OUTPUT
- SYNC INPUT
- Ilya Galkin
- 25.03.2019
- PCBway
- 7
- Motor control board with DSP
- for power design converter
- FR-4
- Author
- Manufacturer
- Date
- Page
- Total pages
- Size page
- A3
- Open Hardware Project
- Materials
- (in symbol PBD-12) Конт.; Цепь
- (in symbol PLD-6) Конт.; Цепь
- (in symbol PLS-2) Конт.; Цепь

### Library data of the parts
C18 = Ceramic_0805: as C12 on sheet Main MCU. Page 1; Package: 0805; HelpURL: https://www.digikey.com/product-detail/en/yageo/CC0805KRX7R9BB103/311-1136-1-ND/303046; Temperature: -55...+125°C
C19 = Ceramic_0805: Manufacturer: Samsung; PartNumber: CL21B475KAFNNNE; ValueManufacturerPartNumber: Ceramic capacitor, 4.7μF, X7R, ±10%, 25V, 0805, -55...+125°C; TypeCapacitor: Ceramic capacitor; Tolerance: ±10%; TypeDielectric: X7R; Package: 0805; HelpURL: https://www.digikey.com/product-detail/en/samsung-electro-mechanics/CL21B475KAFNNNE/1276-2969-1-ND/3891055; Temperature: -55...+125°C
C20 = Ceramic_0805: as C40 on sheet USB and CAN. Page 6; Package: 0805; HelpURL: https://www.digikey.com/product-detail/en/samsung-electro-mechanics/CL21B106KQQNNNE/1276-1113-1-ND/3889199; Temperature: -55...+125°C
C21 C22 = Ceramic_0805: as C1 on sheet Main MCU. Page 1; Package: 0805; HelpURL: https://www.digikey.com/product-detail/en/yageo/CC0805KRX7R7BB104/311-1142-1-ND/303052; Temperature: -55...+125°C
D9 = AP3211KTR-G1: Buck converter; Manufacturer: Diodes Incorporated; ValueManufacturerPartNumber: DC/DC buck converter, input 4.5...18V, 1.4MHz, output 0.81...15V, 1.5A, -40...+85°C, SOT23-6; VoltageInput: input 4.5...18V; Frequency: 1.4MHz; CurrentOutput: 1.5A; VoltageOutput: output 0.81...15V; HelpURL: https://www.digikey.com/product-detail/en/diodes-incorporated/AP3211KTR-G1/AP3211KTR-G1DICT-ND/4505305; Package: SOT23-6; ComponentType: DC/DC buck converter; Temperature: -40...+85°C; PartNumber: AP3211KTR-G1
D10 = SN74LVC2G34DBVR: as D5 on sheet Protection channel A. Page 2; HelpURL: https://www.digikey.com/product-detail/en/texas-instruments/SN74LVC2G34DBVR/296-13496-1-ND/486431; Package: SOT23-6; ComponentType: IC logic buffer; Temperature: -40...+125°C; PartNumber: SN74LVC2G34DBVR
L2 = Inductor_SRP2510A: Manufacturer: Bourns; PartNumber: SRP2510A-4R7M; ValueManufacturerPartNumber: Fixed inductor, 4.7μH, ±20%, SRP2510A, 1.36A, -40...+125°C; TypeInductor: Fixed inductor; MaxCurrent: 1.36A; Package: SRP2510A; HelpURL: https://www.digikey.com/product-detail/en/bourns-inc/SRP2510A-4R7M/SRP2510A-4R7MCT-ND/7354840; Temperature: -40...+125°C
R20 = Resistor_0805: as R1 on sheet Main MCU. Page 1; Package: 0805; HelpURL: https://www.digikey.com/product-detail/en/yageo/RC0805JR-074K7L/311-4.7KARCT-ND/731274; Temperature: -55...+125°C
R21 = Resistor_0805: as R9 on sheet Main MCU. Page 1; Package: 0805; HelpURL: https://www.digikey.com/product-detail/en/yageo/RC0805JR-07470RL/311-470ARCT-ND/731280; Temperature: -55...+125°C
R22 R26-R28 = Resistor_0805: as R4 on sheet Main MCU. Page 1; Package: 0805; HelpURL: https://www.digikey.com/product-detail/en/yageo/RC0805JR-0710KL/311-10KARCT-ND/731188; Temperature: -55...+125°C
R23 = Resistor_0805: Manufacturer: Yageo; PartNumber: RC0805JR-078K2L; ValueManufacturerPartNumber: Resistor film, 8k2, ±5%, 0805, 0.125W, -55...+125°C; TypeResistor: Resistor film; Power: 0.125W; Package: 0805; HelpURL: https://www.digikey.com/product-detail/en/yageo/RC0805JR-078K2L/311-8.2KARCT-ND/731320; Temperature: -55...+125°C
R24 = Resistor_0805: as R3 on sheet Main MCU. Page 1; Package: 0805; HelpURL: https://www.digikey.com/product-detail/en/yageo/RC0805JR-07100RL/311-100ARCT-ND/731185; Temperature: -55...+125°C
R25 = Resistor_0805: Manufacturer: Yageo; PartNumber: RC0805JR-072K7L; ValueManufacturerPartNumber: Resistor film, 2k7, ±5%, 0805, 0.125W, -55...+125°C; TypeResistor: Resistor film; Power: 0.125W; Package: 0805; HelpURL: https://www.digikey.com/product-detail/en/yageo/RC0805JR-072K7L/311-2.7KARCT-ND/731224; Temperature: -55...+125°C
VD8 VD9 = LED_single: as VD3 on sheet Main MCU. Page 1; Package: 0805; HelpURL: https://www.digikey.com/product-detail/en/wurth-electronics-inc/150080VS75000/732-4986-1-ND/4489922; Temperature: -55...+150°C
VD10 VD11 = Schottky_single: Manufacturer: Diodes Incorporated; ValueManufacturerPartNumber: Schottky diode, 40V, 2A, 500mV, 15pF, SOD-123, -55...+150°C; TypeDiode: Schottky diode; Voltage: 40V; Current: 2A; VoltageDrop: 500mV; RecoveryTime: 15pF; Package: SOD-123; HelpURL: https://www.digikey.com/product-detail/en/diodes-incorporated/APD240KDTR-G1/APD240KDTR-G1DICT-ND/7708824; Temperature: -55...+150°C
X3 = PLS-2: Manufacturer: Connfly; ValueManufacturerPartNumber: Connector, 2pin, 2.54mm, 500VAC, 3A; TypeConnector: Connector; VoltageMax: 500VAC; Pitch: 2.54mm; CurrentMax: 3A; Multichannel: 2pin; HelpURL: https://www.chipdip.ru/product/pls-2; PartNumber: PLS-2
X4 = PBD-12: Manufacturer: Connfly; ValueManufacturerPartNumber: Connector, 12pin, 2.54mm, 500VAC, 3A; TypeConnector: Connector; VoltageMax: 500VAC; Pitch: 2.54mm; CurrentMax: 3A; Multichannel: 12pin; HelpURL: https://www.chipdip.ru/product/pbd-12; PartNumber: PBD-12
X5 = PLD-6: as X2 on sheet Protection channel A. Page 2; HelpURL: https://www.chipdip.ru/product/pld-6; PartNumber: PLD-6